# Altium project Kintex_SDR.PrjPcb (part 2 of 3)

## Sheet Codec's.SchDoc: {Наименование}
size 420 x 297 mm; DocumentNumber: ВКА.821011.000.ПЗ; PageSetup: Record=PageOptions|CenterHorizontal=False|CenterVertical=False|PrintScale=0.98|XCorrection=0.00|YCorrection=0.00|PrintKind=1|BorderSize=5000000|LeftOffset=0|BottomOffset=0|Orientation=2|PaperLength=4200|PaperWidth=2970|Scale=100|PaperSource=7|PrintQuality=600|MediaType=1|DitherType=10|PrintScaleMode=1|PaperKind=A3|PaperIndex=8; Rule: PcbType=ProtelPcb
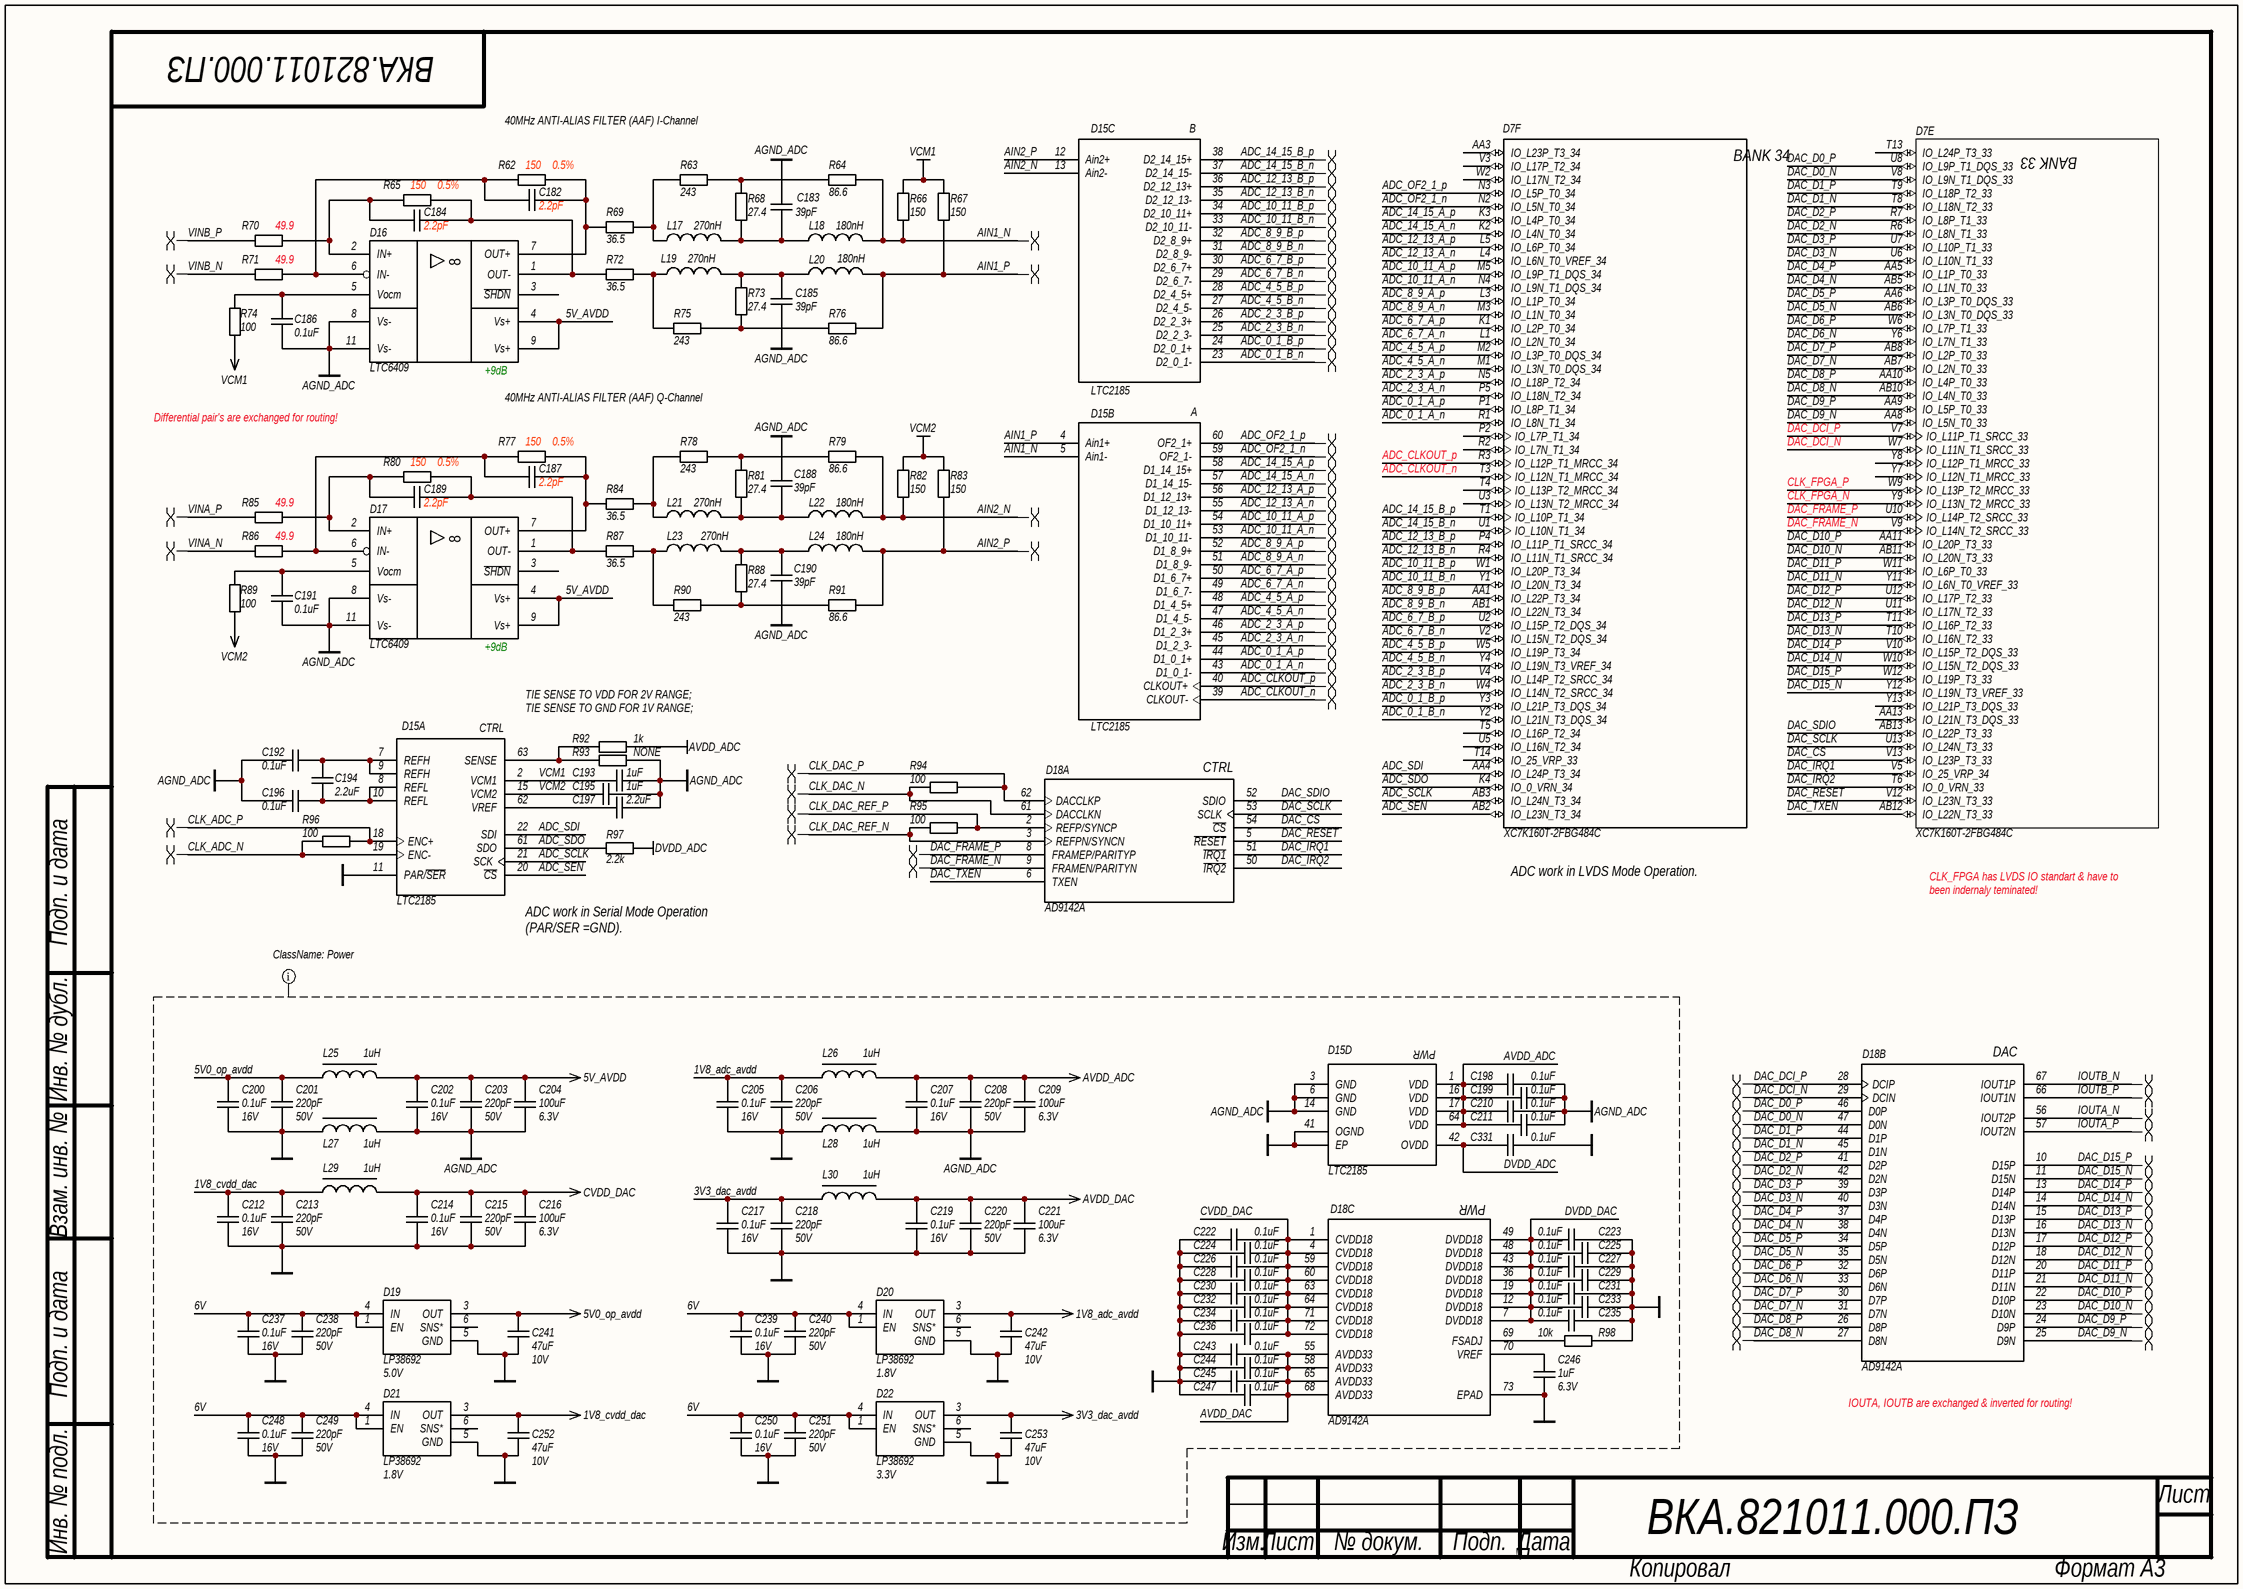
[diagram p3: Codec's.SchDoc]

### Parts
C182  value 2.2pF  [C0402]  (hidden comment: CAP)
C183  value 39pF  [C0402]  (hidden comment: CAP)
C184  value 2.2pF  [C0402]  (hidden comment: CAP)
C185  value 39pF  [C0402]  (hidden comment: CAP)
C186  value 0.1uF  [C0402]  (hidden comment: CAP)
C187  value 2.2pF  [C0402]  (hidden comment: CAP)
C188  value 39pF  [C0402]  (hidden comment: CAP)
C189  value 2.2pF  [C0402]  (hidden comment: CAP)
C190  value 39pF  [C0402]  (hidden comment: CAP)
C191  value 0.1uF  [C0402]  (hidden comment: CAP)
C192  value 0.1uF  [C0402]  (hidden comment: CAP)
C193  value 1uF  [C0402]  (hidden comment: CAP)
C194  value 2.2uF  [C0603]  (hidden comment: CAP)
C195  value 1uF  [C0402]  (hidden comment: CAP)
C196  value 0.1uF  [C0402]  (hidden comment: CAP)
C197  value 2.2uF  [C0603]  (hidden comment: CAP)
C198  value 0.1uF  [C0402]  (hidden comment: CAP)
C199  value 0.1uF  [C0402]  (hidden comment: CAP)
C200  value 0.1uF  Voltage: 16V  [C0603]  (hidden comment: CAP)
C201  value 220pF  Voltage: 50V  [C0603]  (hidden comment: CAP)
C202  value 0.1uF  Voltage: 16V  [C0603]  (hidden comment: CAP)
C203  value 220pF  Voltage: 50V  [C0603]  (hidden comment: CAP)
C204  value 100uF  Voltage: 6.3V  [C1210]  (hidden comment: CAP uF)
C205  value 0.1uF  Voltage: 16V  [C0603]  (hidden comment: CAP)
C206  value 220pF  Voltage: 50V  [C0603]  (hidden comment: CAP)
C207  value 0.1uF  Voltage: 16V  [C0603]  (hidden comment: CAP)
C208  value 220pF  Voltage: 50V  [C0603]  (hidden comment: CAP)
C209  value 100uF  Voltage: 6.3V  [C1210]  (hidden comment: CAP uF)
C210  value 0.1uF  [C0402]  (hidden comment: CAP)
C211  value 0.1uF  [C0402]  (hidden comment: CAP)
C212  value 0.1uF  Voltage: 16V  [C0603]  (hidden comment: CAP)
C213  value 220pF  Voltage: 50V  [C0603]  (hidden comment: CAP)
C214  value 0.1uF  Voltage: 16V  [C0603]  (hidden comment: CAP)
C215  value 220pF  Voltage: 50V  [C0603]  (hidden comment: CAP)
C216  value 100uF  Voltage: 6.3V  [C1210]  (hidden comment: CAP uF)
C217  value 0.1uF  Voltage: 16V  [C0603]  (hidden comment: CAP)
C218  value 220pF  Voltage: 50V  [C0603]  (hidden comment: CAP)
C219  value 0.1uF  Voltage: 16V  [C0603]  (hidden comment: CAP)
C220  value 220pF  Voltage: 50V  [C0603]  (hidden comment: CAP)
C221  value 100uF  Voltage: 6.3V  [C1210]  (hidden comment: CAP uF)
C222  value 0.1uF  [C0402]  (hidden comment: CAP)
C223  value 0.1uF  [C0402]  (hidden comment: CAP)
C224  value 0.1uF  [C0402]  (hidden comment: CAP)
C225  value 0.1uF  [C0402]  (hidden comment: CAP)
C226  value 0.1uF  [C0402]  (hidden comment: CAP)
C227  value 0.1uF  [C0402]  (hidden comment: CAP)
C228  value 0.1uF  [C0402]  (hidden comment: CAP)
C229  value 0.1uF  [C0402]  (hidden comment: CAP)
C230  value 0.1uF  [C0402]  (hidden comment: CAP)
C231  value 0.1uF  [C0402]  (hidden comment: CAP)
C232  value 0.1uF  [C0402]  (hidden comment: CAP)
C233  value 0.1uF  [C0402]  (hidden comment: CAP)
C234  value 0.1uF  [C0402]  (hidden comment: CAP)
C235  value 0.1uF  [C0402]  (hidden comment: CAP)
C236  value 0.1uF  [C0402]  (hidden comment: CAP)
C237  value 0.1uF  Voltage: 16V  [C0603]  (hidden comment: CAP)
C238  value 220pF  Voltage: 50V  [C0603]  (hidden comment: CAP)
C239  value 0.1uF  Voltage: 16V  [C0603]  (hidden comment: CAP)
C240  value 220pF  Voltage: 50V  [C0603]  (hidden comment: CAP)
C241  value 47uF  Voltage: 10V  [C1210]  (hidden comment: CAP uF)
C242  value 47uF  Voltage: 10V  [C1210]  (hidden comment: CAP uF)
C243  value 0.1uF  [C0402]  (hidden comment: CAP)
C244  value 0.1uF  [C0402]  (hidden comment: CAP)
C245  value 0.1uF  [C0402]  (hidden comment: CAP)
C246  value 1uF  Voltage: 6.3V  [C0402]  (hidden comment: CAP)
C247  value 0.1uF  [C0402]  (hidden comment: CAP)
C248  value 0.1uF  Voltage: 16V  [C0603]  (hidden comment: CAP)
C249  value 220pF  Voltage: 50V  [C0603]  (hidden comment: CAP)
C250  value 0.1uF  Voltage: 16V  [C0603]  (hidden comment: CAP)
C251  value 220pF  Voltage: 50V  [C0603]  (hidden comment: CAP)
C252  value 47uF  Voltage: 10V  [C1210]  (hidden comment: CAP uF)
C253  value 47uF  Voltage: 10V  [C1210]  (hidden comment: CAP uF)
C331  value 0.1uF  [C0402]  (hidden comment: CAP)
D7  XC7K160T-2FBG484C  [FBG484]  (parts E,F of 12)
D15  LTC2185  [QFN-64]  (parts A,B,C,D of 4)
D16  LTC6409  [QFN-10]
D17  LTC6409  [QFN-10]
D18  AD9142A  [LFCSP_VQ-72]  (parts A,B,C of 3)
D19  LP38692  Voltage: 5.0V  [SOT-223-5]
D20  LP38692  Voltage: 1.8V  [SOT-223-5]
D21  LP38692  Voltage: 1.8V  [SOT-223-5]
D22  LP38692  Voltage: 3.3V  [SOT-223-5]
L17  value 270nH  [L0603]  (hidden comment: Inductor RF)
L18  value 180nH  [L0603]  (hidden comment: Inductor RF)
L19  value 270nH  [L0603]  (hidden comment: Inductor RF)
L20  value 180nH  [L0603]  (hidden comment: Inductor RF)
L21  value 270nH  [L0603]  (hidden comment: Inductor RF)
L22  value 180nH  [L0603]  (hidden comment: Inductor RF)
L23  value 270nH  [L0603]  (hidden comment: Inductor RF)
L24  value 180nH  [L0603]  (hidden comment: Inductor RF)
L25  value 1uH  [L1210_Murata]  (hidden comment: Inductor LF)
L26  value 1uH  [L1210_Murata]  (hidden comment: Inductor LF)
L27  value 1uH  [L1210_Murata]  (hidden comment: Inductor LF)
L28  value 1uH  [L1210_Murata]  (hidden comment: Inductor LF)
L29  value 1uH  [L1210_Murata]  (hidden comment: Inductor LF)
L30  value 1uH  [L1210_Murata]  (hidden comment: Inductor LF)
R62  value 150  Tolerance: 0.5%  [R0402]  (hidden comment: RES)
R63  value 243  [R0402]  (hidden comment: RES)
R64  value 86.6  [R0402]  (hidden comment: RES)
R65  value 150  Tolerance: 0.5%  [R0402]  (hidden comment: RES)
R66  value 150  [R0402]  (hidden comment: RES)
R67  value 150  [R0402]  (hidden comment: RES)
R68  value 27.4  [R0402]  (hidden comment: RES)
R69  value 36.5  [R0402]  (hidden comment: RES)
R70  value 49.9  [R0402]  (hidden comment: RES)
R71  value 49.9  [R0402]  (hidden comment: RES)
R72  value 36.5  [R0402]  (hidden comment: RES)
R73  value 27.4  [R0402]  (hidden comment: RES)
R74  value 100  [R0402]  (hidden comment: RES)
R75  value 243  [R0402]  (hidden comment: RES)
R76  value 86.6  [R0402]  (hidden comment: RES)
R77  value 150  Tolerance: 0.5%  [R0402]  (hidden comment: RES)
R78  value 243  [R0402]  (hidden comment: RES)
R79  value 86.6  [R0402]  (hidden comment: RES)
R80  value 150  Tolerance: 0.5%  [R0402]  (hidden comment: RES)
R81  value 27.4  [R0402]  (hidden comment: RES)
R82  value 150  [R0402]  (hidden comment: RES)
R83  value 150  [R0402]  (hidden comment: RES)
R84  value 36.5  [R0402]  (hidden comment: RES)
R85  value 49.9  [R0402]  (hidden comment: RES)
R86  value 49.9  [R0402]  (hidden comment: RES)
R87  value 36.5  [R0402]  (hidden comment: RES)
R88  value 27.4  [R0402]  (hidden comment: RES)
R89  value 100  [R0402]  (hidden comment: RES)
R90  value 243  [R0402]  (hidden comment: RES)
R91  value 86.6  [R0402]  (hidden comment: RES)
R92  value 1k  [R0402]  (hidden comment: RES)
R93  value NONE  [R0402]  (hidden comment: RES)
R94  value 100  [R0402]  (hidden comment: RES)
R95  value 100  [R0402]  (hidden comment: RES)
R96  value 100  [R0402]  (hidden comment: RES)
R97  value 2.2k  [R0402]  (hidden comment: RES)
R98  value 10k  [R0402]  (hidden comment: RES)

### Nets
1V8_adc_avdd: C205.2 C206.2 C242.2 D20.3(OUT) L26.1
1V8_cvdd_dac: C212.2 C213.2 C252.2 D21.3(OUT) L29.1
3V3_dac_avdd: C217.2 C218.2 C253.2 D22.3(OUT) L30.1
5V0_op_avdd: C200.2 C201.2 C241.2 D19.3(OUT) L25.1
5V_AVDD: C202.2 C203.2 C204.2 D16.4(Vs+) D16.9(Vs+) D17.4(Vs+) D17.9(Vs+) L25.2
6V: C237.2 C238.2 C239.2 C240.2 C248.2 C249.2 C250.2 C251.2 D19.1(EN) D19.4(IN) D20.1(EN) D20.4(IN) D21.1(EN) D21.4(IN) D22.1(EN) D22.4(IN)
AGND_ADC: C183.1 C185.2 C186.1 C188.1 C190.2 C191.1 C192.2 C193.1 C195.1 C196.2 C197.1 C198.2 C199.2 C202.1 C203.1 C204.1 C207.1 C208.1 C209.1 C210.2 C211.2 D15.3(GND) D15.6(GND) D15.14(GND) D16.8(Vs-) D16.11(Vs-) D17.8(Vs-) D17.11(Vs-) L27.2 L28.2 R93.2  [project net AGND_RX]
AVDD_ADC: C198.1 C199.1 C207.2 C208.2 C209.2 C210.1 C211.1 D15.1(VDD) D15.16(VDD) D15.17(VDD) D15.64(VDD) L26.2 R92.2
AVDD_DAC: C219.2 C220.2 C221.2 C243.2 C244.2 C245.2 C247.2 D18.55(AVDD33) D18.58(AVDD33) D18.65(AVDD33) D18.68(AVDD33) L30.2
CVDD_DAC: C214.2 C215.2 C216.2 C222.2 C224.2 C226.2 C228.2 C230.2 C232.2 C234.2 C236.2 D18.1(CVDD18) D18.4(CVDD18) D18.59(CVDD18) D18.60(CVDD18) D18.63(CVDD18) D18.64(CVDD18) D18.71(CVDD18) D18.72(CVDD18) L29.2
DVDD_ADC: C331.1 D15.42(OVDD) R97.1
DVDD_DAC: C223.1 C225.1 C227.1 C229.1 C231.1 C233.1 C235.1 D18.7(DVDD18) D18.12(DVDD18) D18.19(DVDD18) D18.36(DVDD18) D18.43(DVDD18) D18.48(DVDD18) D18.49(DVDD18)
GND: C200.1 C201.1 C205.1 C206.1 C212.1 C213.1 C214.1 C215.1 C216.1 C217.1 C218.1 C219.1 C220.1 C221.1 C222.1 C223.2 C224.1 C225.2 C226.1 C227.2 C228.1 C229.2 C230.1 C231.2 C232.1 C233.2 C234.1 C235.2 C236.1 C237.1 C238.1 C239.1 C240.1 C241.1 C242.1 C243.1 C244.1 C245.1 C246.1 C247.1 C248.1 C249.1 C250.1 C251.1 C252.1 C253.1 C331.2 D15.0(EP) D15.11(PAR/~{SER}) D15.41(OGND) D18.73(EPAD) D19.5(GND) D20.5(GND) D21.5(GND) D22.5(GND) L27.1 L28.1 R98.2  [project net AGND_TX]
VCM1: C193.2 D15.2(VCM1) R66.2 R67.1 R74.2
VCM2: C195.2 D15.15(VCM2) R82.1 R83.1 R89.2
ADC_0_1_A_n: D7.R1(IO_L8N_T1_34) D15.43(D1_0_1-)
ADC_0_1_A_p: D7.P1(IO_L8P_T1_34) D15.44(D1_0_1+)
ADC_0_1_B_n: D7.Y2(IO_L21N_T3_DQS_34) D15.23(D2_0_1-)
ADC_0_1_B_p: D7.Y3(IO_L21P_T3_DQS_34) D15.24(D2_0_1+)
ADC_2_3_A_n: D7.P5(IO_L18N_T2_34) D15.45(D1_2_3-)
ADC_2_3_A_p: D7.N5(IO_L18P_T2_34) D15.46(D1_2_3+)
ADC_2_3_B_n: D7.W4(IO_L14N_T2_SRCC_34) D15.25(D2_2_3-)
ADC_2_3_B_p: D7.V4(IO_L14P_T2_SRCC_34) D15.26(D2_2_3+)
ADC_4_5_A_n: D7.M1(IO_L3N_T0_DQS_34) D15.47(D1_4_5-)
ADC_4_5_A_p: D7.M2(IO_L3P_T0_DQS_34) D15.48(D1_4_5+)
ADC_4_5_B_n: D7.Y4(IO_L19N_T3_VREF_34) D15.27(D2_4_5-)
ADC_4_5_B_p: D7.W5(IO_L19P_T3_34) D15.28(D2_4_5+)
ADC_6_7_A_n: D7.L1(IO_L2N_T0_34) D15.49(D1_6_7-)
ADC_6_7_A_p: D7.K1(IO_L2P_T0_34) D15.50(D1_6_7+)
ADC_6_7_B_n: D7.V2(IO_L15N_T2_DQS_34) D15.29(D2_6_7-)
ADC_6_7_B_p: D7.U2(IO_L15P_T2_DQS_34) D15.30(D2_6_7+)
ADC_8_9_A_n: D7.M3(IO_L1N_T0_34) D15.51(D1_8_9-)
ADC_8_9_A_p: D7.L3(IO_L1P_T0_34) D15.52(D1_8_9+)
ADC_8_9_B_n: D7.AB1(IO_L22N_T3_34) D15.31(D2_8_9-)
ADC_8_9_B_p: D7.AA1(IO_L22P_T3_34) D15.32(D2_8_9+)
ADC_10_11_A_n: D7.N4(IO_L9N_T1_DQS_34) D15.53(D1_10_11-)
ADC_10_11_A_p: D7.M5(IO_L9P_T1_DQS_34) D15.54(D1_10_11+)
ADC_10_11_B_n: D7.Y1(IO_L20N_T3_34) D15.33(D2_10_11-)
ADC_10_11_B_p: D7.W1(IO_L20P_T3_34) D15.34(D2_10_11+)
ADC_12_13_A_n: D7.L4(IO_L6N_T0_VREF_34) D15.55(D1_12_13-)
ADC_12_13_A_p: D7.L5(IO_L6P_T0_34) D15.56(D1_12_13+)
ADC_12_13_B_n: D7.R4(IO_L11N_T1_SRCC_34) D15.35(D2_12_13-)
ADC_12_13_B_p: D7.P4(IO_L11P_T1_SRCC_34) D15.36(D2_12_13+)
ADC_14_15_A_n: D7.K2(IO_L4N_T0_34) D15.57(D1_14_15-)
ADC_14_15_A_p: D7.K3(IO_L4P_T0_34) D15.58(D1_14_15+)
ADC_14_15_B_n: D7.U1(IO_L10N_T1_34) D15.37(D2_14_15-)
ADC_14_15_B_p: D7.T1(IO_L10P_T1_34) D15.38(D2_14_15+)
ADC_CLKOUT_n: D7.T3(IO_L12N_T1_MRCC_34) D15.39(CLKOUT-)
ADC_CLKOUT_p: D7.R3(IO_L12P_T1_MRCC_34) D15.40(CLKOUT+)
ADC_OF2_1_n: D7.N2(IO_L5N_T0_34) D15.59(OF2_1-)
ADC_OF2_1_p: D7.N3(IO_L5P_T0_34) D15.60(OF2_1+)
ADC_SCLK: D7.AB3(IO_L24N_T3_34) D15.21(SCK)
ADC_SDI: D7.AA4(IO_L24P_T3_34) D15.22(SDI)
ADC_SDO: D7.K4(IO_0_VRN_34) D15.61(SDO) R97.2
ADC_SEN: D7.AB2(IO_L23N_T3_34) D15.20(~{CS})
AIN1_N: D15.5(Ain1-) L18.2 R64.2 R66.1
AIN1_P: D15.4(Ain1+) L20.2 R67.2 R76.2
AIN2_N: D15.13(Ain2-) L22.2 R79.2 R82.2
AIN2_P: D15.12(Ain2+) L24.2 R83.2 R91.2
CLK_ADC_N: D15.19(ENC-) R96.1
CLK_ADC_P: D15.18(ENC+) R96.2
CLK_DAC_N: D18.61(DACCLKN) R94.1
CLK_DAC_P: D18.62(DACCLKP) R94.2
CLK_DAC_REF_N: D18.3(REFPN/SYNCN) R95.1
CLK_DAC_REF_P: D18.2(REFP/SYNCP) R95.2
CLK_FPGA_N: D7.Y9(IO_L13N_T2_MRCC_33)
CLK_FPGA_P: D7.W9(IO_L13P_T2_MRCC_33)
DAC_CS: D7.V13(IO_L23P_T3_33) D18.54(~{CS})
DAC_D0_N: D7.V8(IO_L9N_T1_DQS_33) D18.47(D0N)
DAC_D0_P: D7.U8(IO_L9P_T1_DQS_33) D18.46(D0P)
DAC_D1_N: D7.T8(IO_L18N_T2_33) D18.45(D1N)
DAC_D1_P: D7.T9(IO_L18P_T2_33) D18.44(D1P)
DAC_D2_N: D7.R6(IO_L8N_T1_33) D18.42(D2N)
DAC_D2_P: D7.R7(IO_L8P_T1_33) D18.41(D2P)
DAC_D3_N: D7.U6(IO_L10N_T1_33) D18.40(D3N)
DAC_D3_P: D7.U7(IO_L10P_T1_33) D18.39(D3P)
DAC_D4_N: D7.AB5(IO_L1N_T0_33) D18.38(D4N)
DAC_D4_P: D7.AA5(IO_L1P_T0_33) D18.37(D4P)
DAC_D5_N: D7.AB6(IO_L3N_T0_DQS_33) D18.35(D5N)
DAC_D5_P: D7.AA6(IO_L3P_T0_DQS_33) D18.34(D5P)
DAC_D6_N: D7.Y6(IO_L7N_T1_33) D18.33(D6N)
DAC_D6_P: D7.W6(IO_L7P_T1_33) D18.32(D6P)
DAC_D7_N: D7.AB7(IO_L2N_T0_33) D18.31(D7N)
DAC_D7_P: D7.AB8(IO_L2P_T0_33) D18.30(D7P)
DAC_D8_N: D7.AB10(IO_L4N_T0_33) D18.27(D8N)
DAC_D8_P: D7.AA10(IO_L4P_T0_33) D18.26(D8P)
DAC_D9_N: D7.AA8(IO_L5N_T0_33) D18.25(D9N)
DAC_D9_P: D7.AA9(IO_L5P_T0_33) D18.24(D9P)
DAC_D10_N: D7.AB11(IO_L20N_T3_33) D18.23(D10N)
DAC_D10_P: D7.AA11(IO_L20P_T3_33) D18.22(D10P)
DAC_D11_N: D7.Y11(IO_L6N_T0_VREF_33) D18.21(D11N)
DAC_D11_P: D7.W11(IO_L6P_T0_33) D18.20(D11P)
DAC_D12_N: D7.U11(IO_L17N_T2_33) D18.18(D12N)
DAC_D12_P: D7.U12(IO_L17P_T2_33) D18.17(D12P)
DAC_D13_N: D7.T10(IO_L16N_T2_33) D18.16(D13N)
DAC_D13_P: D7.T11(IO_L16P_T2_33) D18.15(D13P)
DAC_D14_N: D7.W10(IO_L15N_T2_DQS_33) D18.14(D14N)
DAC_D14_P: D7.V10(IO_L15P_T2_DQS_33) D18.13(D14P)
DAC_D15_N: D7.Y12(IO_L19N_T3_VREF_33) D18.11(D15N)
DAC_D15_P: D7.W12(IO_L19P_T3_33) D18.10(D15P)
DAC_DCI_N: D7.W7(IO_L11N_T1_SRCC_33) D18.29(DCIN)
DAC_DCI_P: D7.V7(IO_L11P_T1_SRCC_33) D18.28(DCIP)
DAC_FRAME_N: D7.V9(IO_L14N_T2_SRCC_33) D18.9(FRAMEN/PARITYN)
DAC_FRAME_P: D7.U10(IO_L14P_T2_SRCC_33) D18.8(FRAMEP/PARITYP)
DAC_IRQ1: D7.V5(IO_25_VRP_34) D18.51(~{IRQ1})
DAC_IRQ2: D7.T6(IO_0_VRN_33) D18.50(~{IRQ2})
DAC_RESET: D7.V12(IO_L23N_T3_33) D18.5(~{RESET})
DAC_SCLK: D7.U13(IO_L24N_T3_33) D18.53(SCLK)
DAC_SDIO: D7.AB13(IO_L22P_T3_33) D18.52(SDIO)
DAC_TXEN: D7.AB12(IO_L22N_T3_33) D18.6(TXEN)
IOUTA_N: D18.56(IOUT2P)
IOUTA_P: D18.57(IOUT2N)
IOUTB_N: D18.67(IOUT1P)
IOUTB_P: D18.66(IOUT1N)
VINA_N: R86.2
VINA_P: R85.2
VINB_N: R71.2
VINB_P: R70.2
NetC182_1: C182.1 D16.6(IN-) R62.1 R71.1
NetC182_2: C182.2 D16.7(OUT+) R62.2 R69.2
NetC183_2: C183.2 L17.2 L18.1 R68.2
NetC184_1: C184.1 D16.2(IN+) R65.1 R70.1
NetC184_2: C184.2 D16.1(OUT-) R65.2 R72.2
NetC185_1: C185.1 L19.2 L20.1 R73.1
NetC186_2: C186.2 D16.5(Vocm) R74.1
NetC187_1: C187.1 D17.6(IN-) R77.1 R86.1
NetC187_2: C187.2 D17.7(OUT+) R77.2 R84.2
NetC188_2: C188.2 L21.2 L22.1 R81.2
NetC189_1: C189.1 D17.2(IN+) R80.1 R85.1
NetC189_2: C189.2 D17.1(OUT-) R80.2 R87.2
NetC190_1: C190.1 L23.2 L24.1 R88.1
NetC191_2: C191.2 D17.5(Vocm) R89.1
NetC192_1: C192.1 C194.1 D15.7(REFH) D15.9(REFH)
NetC194_2: C194.2 C196.1 D15.8(REFL) D15.10(REFL)
NetC197_2: C197.2 D15.62(VREF)
NetC246_2: C246.2 D18.70(VREF)
NetD15_63: D15.63(SENSE) R92.1 R93.1
NetD18_69: D18.69(FSADJ) R98.1
NetL17_1: L17.1 R63.1 R69.1
NetL19_1: L19.1 R72.1 R75.1
NetL21_1: L21.1 R78.1 R84.1
NetL23_1: L23.1 R87.1 R90.1
NetR63_2: R63.2 R64.1 R68.1
NetR73_2: R73.2 R75.2 R76.1
NetR78_2: R78.2 R79.1 R81.1
NetR88_2: R88.2 R90.2 R91.1

Not connected (* = marked no-connect by the designer): D7 AA3(IO_L23P_T3_34) AA13(IO_L21N_T3_DQS_33) P2(IO_L7P_T1_34) R2(IO_L7N_T1_34) T4(IO_L13P_T2_MRCC_34) T5(IO_L16P_T2_34) T13(IO_L24P_T3_33) T14(IO_25_VRP_33) U3(IO_L13N_T2_MRCC_34) U5(IO_L16N_T2_34) V3(IO_L17P_T2_34) W2(IO_L17N_T2_34) Y7(IO_L12N_T1_MRCC_33) Y8(IO_L12P_T1_MRCC_33) Y13(IO_L21P_T3_DQS_33); D16 3(~{SHDN}); D17 3(~{SHDN}); D19 6(SNS*); D20 6(SNS*); D21 6(SNS*); D22 6(SNS*)

### Layout directives
differential pair: ADC_0_1_A_n, ADC_0_1_A_p, ADC_0_1_B_n, ADC_0_1_B_p, ADC_2_3_A_n, ADC_2_3_A_p, ADC_2_3_B_n, ADC_2_3_B_p, ADC_4_5_A_n, ADC_4_5_A_p, ADC_4_5_B_n, ADC_4_5_B_p, ADC_6_7_A_n, ADC_6_7_A_p, ADC_6_7_B_n, ADC_6_7_B_p, ADC_8_9_A_n, ADC_8_9_A_p, ADC_8_9_B_n, ADC_8_9_B_p, ADC_10_11_A_n, ADC_10_11_A_p, ADC_10_11_B_n, ADC_10_11_B_p, ADC_12_13_A_n, ADC_12_13_A_p, ADC_12_13_B_n, ADC_12_13_B_p, ADC_14_15_A_n, ADC_14_15_A_p, ADC_14_15_B_n, ADC_14_15_B_p, ADC_CLKOUT_n, ADC_CLKOUT_p, ADC_OF2_1_n, ADC_OF2_1_p, AIN1_N, AIN1_P, AIN2_N, AIN2_P, CLK_ADC_N, CLK_ADC_P, CLK_DAC_N, CLK_DAC_P, CLK_DAC_REF_N, CLK_DAC_REF_P, DAC_D0_N, DAC_D0_P, DAC_D1_N, DAC_D1_P, DAC_D2_N, DAC_D2_P, DAC_D3_N, DAC_D3_P, DAC_D4_N, DAC_D4_P, DAC_D5_N, DAC_D5_P, DAC_D6_N, DAC_D6_P, DAC_D7_N, DAC_D7_P, DAC_D8_N, DAC_D8_P, DAC_D9_N, DAC_D9_P, DAC_D10_N, DAC_D10_P, DAC_D11_N, DAC_D11_P, DAC_D12_N, DAC_D12_P, DAC_D13_N, DAC_D13_P, DAC_D14_N, DAC_D14_P, DAC_D15_N, DAC_D15_P, DAC_DCI_N, DAC_DCI_P, DAC_FRAME_N, DAC_FRAME_P, IOUTA_N, IOUTA_P, IOUTB_N, IOUTB_P, VINA_N, VINA_P, VINB_N, VINB_P
net class Power: 1V8_adc_avdd, 1V8_cvdd_dac, 3V3_dac_avdd, 5V0_op_avdd, 5V_AVDD, 6V, AGND_ADC, AVDD_ADC, AVDD_DAC, CVDD_DAC, DVDD_ADC, DVDD_DAC, GND

### Notes on the sheet
- 40MHz ANTI-ALIAS FILTER (AAF) I-Channel
- (near D16) +9dB
- Differential pair's are exchanged for routing!
- 40MHz ANTI-ALIAS FILTER (AAF) Q-Channel
- (near D17) +9dB
- TIE SENSE TO VDD FOR 2V RANGE;
  TIE SENSE TO GND FOR 1V RANGE;
- ADC work in Serial Mode Operation (PAR/SER =GND).
- (near D7) ADC work in LVDS Mode Operation.
- CLK_FPGA has LVDS IO standart & have to been indernaly teminated!
- IOUTA, IOUTB are exchanged & inverted for routing!
- Подп. и дата
- Инв. № дубл.
- Взам. инв. №
- Инв. № подл.
- Лист
- Изм.
- № докум.
- Подп.
- Дата
- Копировал
- Формат А3
- (in symbol AD9142A, part A) CTRL
- (in symbol AD9142A, part B) DAC
- (in symbol AD9142A, part C) PWR
- (in symbol LTC2185, part A) CTRL
- (in symbol LTC2185, part B) A
- (in symbol LTC2185, part C) B
- (in symbol LTC2185, part D) PWR
- (in symbol XC7K160T-2FBG484C, part E) BANK 33
- (in symbol XC7K160T-2FBG484C, part F) BANK 34

### Library data of the parts
C182 C184 C187 C189 = CAP: SMD Capacitor; Manufacturer: Murata; Material: NP0; Tolerance: 0.1pF; Voltage: 25V; Type: Ceramic Capacitor; P/N: GRM1555C1E2R2BA01D
C183 C185 C188 C190 = CAP: SMD Capacitor; Manufacturer: Murata; Material: NP0; Tolerance: 1%; Voltage: 50V; Type: Ceramic Capacitor; P/N: GRM1555C1H390FA01D
C186 C191 C192 C196 = CAP: SMD Capacitor; Manufacturer: Murata; Material: X7R; Tolerance: 10%; Voltage: 50V; Type: Ceramic Capacitor; P/N: GRM155R71H104KE14J
C193 C195 = CAP: SMD Capacitor; Manufacturer: Murata; Material: X7R; Tolerance: 10%; Voltage: 6.3V; Type: Ceramic Capacitor; P/N: GRM155R70J105KA12D
C194 C197 = CAP: SMD Capacitor; Manufacturer: Murata; Material: X7R; Tolerance: 10%; Voltage: 10V; Type: Ceramic Capacitor; P/N: GRM188R71A225KE15D
C198 C199 C210 C211 C222-C236 C243-C245 C247 C331 = CAP: SMD Capacitor; Manufacturer: Murata; Material: X7R; Tolerance: 10%; Voltage: 16V; Type: Ceramic Capacitor; P/N: GRM155R71C104KA88J
C200 C202 C205 C207 C212 C214 C217 C219 C237 C239 C248 C250 = CAP: SMD Capacitor; Manufacturer: Murata; Material: X7R; Tolerance: 10%; Type: Ceramic Capacitor; P/N: GRM188R71C104KA01D
C201 C203 C206 C208 C213 C215 C218 C220 C238 C240 C249 C251 = CAP: SMD Capacitor; Manufacturer: Murata; Material: X7R; Tolerance: 10%; Type: Ceramic Capacitor; P/N: GRM188R71H221KA01D
C204 C209 C216 C221 = CAP uF: SMD Capacitor; Manufacturer: Murata; Material: X5R; Tolerance: 20%; Type: Ceramic Capacitor; P/N: GRM32ER60J107ME20L
C241 C242 C252 C253 = CAP uF: SMD Capacitor; Manufacturer: Murata; Material: X7R; Tolerance: 10%; Type: Ceramic Capacitor; P/N: GRM32ER71A476KE15L
C246 = CAP: SMD Capacitor; Manufacturer: Murata; Material: X7R; Tolerance: 10%; Type: Ceramic Capacitor; P/N: GRM155R70J105KA12D
D7 = XC7K160T-2FBG484C: Xilinx 7-Series FPGA; Speed Grade: -2; Manufacturer: Xilinx; Name: XC7K160T-2FBG484C; Series: 7-Series FPGA; Package: 484 Ball FBG
D15 = LTC2185: Dual 16-Bit, 125Msps  Low Power 3V ADC; Name: LTC2185CUP#PBF-ND; Power Dissipation: 370mW; Resolution: 16 Bits; Sampling Frequency: 125 MHz; Type: Dual 16-Bit, 105Msps  Low Power 3V ADC; Voltage: Single 1.8V Supply; Package: 64-Pin (9mm × 9mm) QFN; Temperature Range: 0°C to 70°C
D16 D17 = LTC6409: Differential Amplifier/ADC   Driver; Manufacturer: Linear Technology; Name: LTC6409CUDB#TRMPBF; Voltage: 2.7V to 5.25V; Type: Very high speed, low distortion, differential amplifier.; Package: 10-Lead 3mm ×2mm ×0.75mm QFN; Temperature Range: –40°C to 125°C
D18 = AD9142A: Dual, 16-Bit, 1600 MSPS, TxDAC+   Digital-to-Analog Converter; Name: AD9142ABCPZ; Power Dissipation: 1.5 W at 1.25 GSPS; Resolution: 16 bit; Sampling Frequency: 575 MHz; Voltage: 3.3V, 1.8V; Package: 72-lead LFCSP; Temperature Range: −40°C to +85°C; Type: Dual, 16-Bit, 1600 MSPS, TxDAC+   Digital-to-Analog Converter
D19 = LP38692: Linear Regulator; P/N: LP38692MP-5.0/NOPB
D20 D21 = LP38692: Linear Regulator; P/N: LP38692MP-1.8/NOPB
D22 = LP38692: Linear Regulator; P/N: LP38692MP-3.3/NOPB
L17 L19 L21 L23 = Inductor RF: Chip SMD Inductor; Manufacturer: Murata; Current: 250mA; Frequency: 1.25GHz; Name: LQW18; Tolerance: ±2%; P/N: LQW18ANR27G80D; Series: LQW; Temperature Range: -25…85°C
L18 L20 L22 L24 = Inductor RF: Chip SMD Inductor; Manufacturer: Murata; Current: 250mA; Frequency: 1.35GHz; Name: LQW18; Tolerance: ±2%; P/N: LQW18ANR18G80D; Series: LQW; Temperature Range: -25…85°C
L25-L30 = Inductor LF: Inductor Power Lines; Manufacturer: Murata; Name: LQM32PN1R0MG0; Current: 2500mA; Tolerance: 5%; Frequency: 100MHz; Temperature Range: -25ºC to 85ºC; P/N: LQM32PN1R0MG0
  L25-L27: Series: LQM
  L28 L30: Series: LQM32
  L29: Series: LQH
R62 R65 R77 R80 = RES: SMD Resistor; Manufacturer: Panasonic Electronic Components; Name: Chip SMD Resistor; Power: 0.062 Wt; P/N: ERJ-2RHD1500X; Temperature Range: -55…155°C
R63 R75 R78 R90 = RES: SMD Resistor; Manufacturer: Panasonic Electronic Components; Name: Chip SMD Resistor; Power: 0.062 Wt; Tolerance: 1%; P/N: ERJ-2RKF2430X; Temperature Range: -55…155°C
R64 R76 R79 R91 = RES: SMD Resistor; Manufacturer: Panasonic Electronic Components; Name: Chip SMD Resistor; Power: 0.062 Wt; Tolerance: 1%; P/N: ERJ-2RKF86R6X; Temperature Range: -55…155°C
R66 R67 R82 R83 = RES: SMD Resistor; Manufacturer: Panasonic Electronic Components; Name: Chip SMD Resistor; Power: 0.062 Wt; Tolerance: 1%; P/N: ERJ-2RKF1500X; Temperature Range: -55…155°C
R68 R73 R81 R88 = RES: SMD Resistor; Manufacturer: Panasonic Electronic Components; Name: Chip SMD Resistor; Power: 0.062 Wt; Tolerance: 1%; P/N: ERJ-2RKF27R4X; Temperature Range: -55…155°C
R69 R72 R84 R87 = RES: SMD Resistor; Manufacturer: Panasonic Electronic Components; Name: Chip SMD Resistor; Power: 0.062 Wt; Tolerance: 1%; P/N: ERJ-2RKF36R5X; Temperature Range: -55…155°C
R70 R71 R85 R86 = RES: SMD Resistor; Manufacturer: Panasonic Electronic Components; Name: Chip SMD Resistor; Power: 0.063 Wt; Tolerance: 0.5%; P/N: ERJ-2RKD49R9X; Temperature Range: -55…155°C
R74 R89 R94-R96 = RES: SMD Resistor; Manufacturer: Panasonic Electronic Components; Name: Chip SMD Resistor; Power: 0.062 Wt; Tolerance: 5%; P/N: ERJ-2GEJ101X; Temperature Range: -55…155°C
R92 = RES: SMD Resistor; Manufacturer: Panasonic Electronic Components; Name: Chip SMD Resistor; Power: 0.062 Wt; Tolerance: 5%; P/N: ERJ-2GEJ102X; Temperature Range: -55…155°C
R93 = RES: SMD Resistor; Manufacturer: Panasonic Electronic Components; Name: Chip SMD Resistor; Power: 0.062 Wt; P/N: ERJ-2GE0R00X; Temperature Range: -55…155°C
R97 = RES: SMD Resistor; Name: Chip SMD Resistor; Power: 0.062 Wt; Tolerance: 5%; P/N: ERJ-2GEJ222X; Temperature Range: -55…155°C
R98 = RES: SMD Resistor; Manufacturer: Panasonic Electronic Components; Name: Chip SMD Resistor; Power: 0.062 Wt; Tolerance: 5%; P/N: ERJ-2GEJ103X; Temperature Range: -55…155°C

## Sheet DaughterBoard.SchDoc: {Наименование}
size 420 x 297 mm; DocumentNumber: ВКА.821011.000.ПЗ; PageSetup: Record=PageOptions|CenterHorizontal=False|CenterVertical=False|PrintScale=0.95|XCorrection=0.00|YCorrection=0.00|PrintKind=1|BorderSize=5000000|LeftOffset=0|BottomOffset=0|Orientation=1|PaperLength=1000|PaperWidth=1000|Scale=100|PaperSource=15|PrintQuality=600|MediaType=1|DitherType=10|PaperKind=A4|PrintScaleMode=1; Rule: PcbType=ProtelPcb
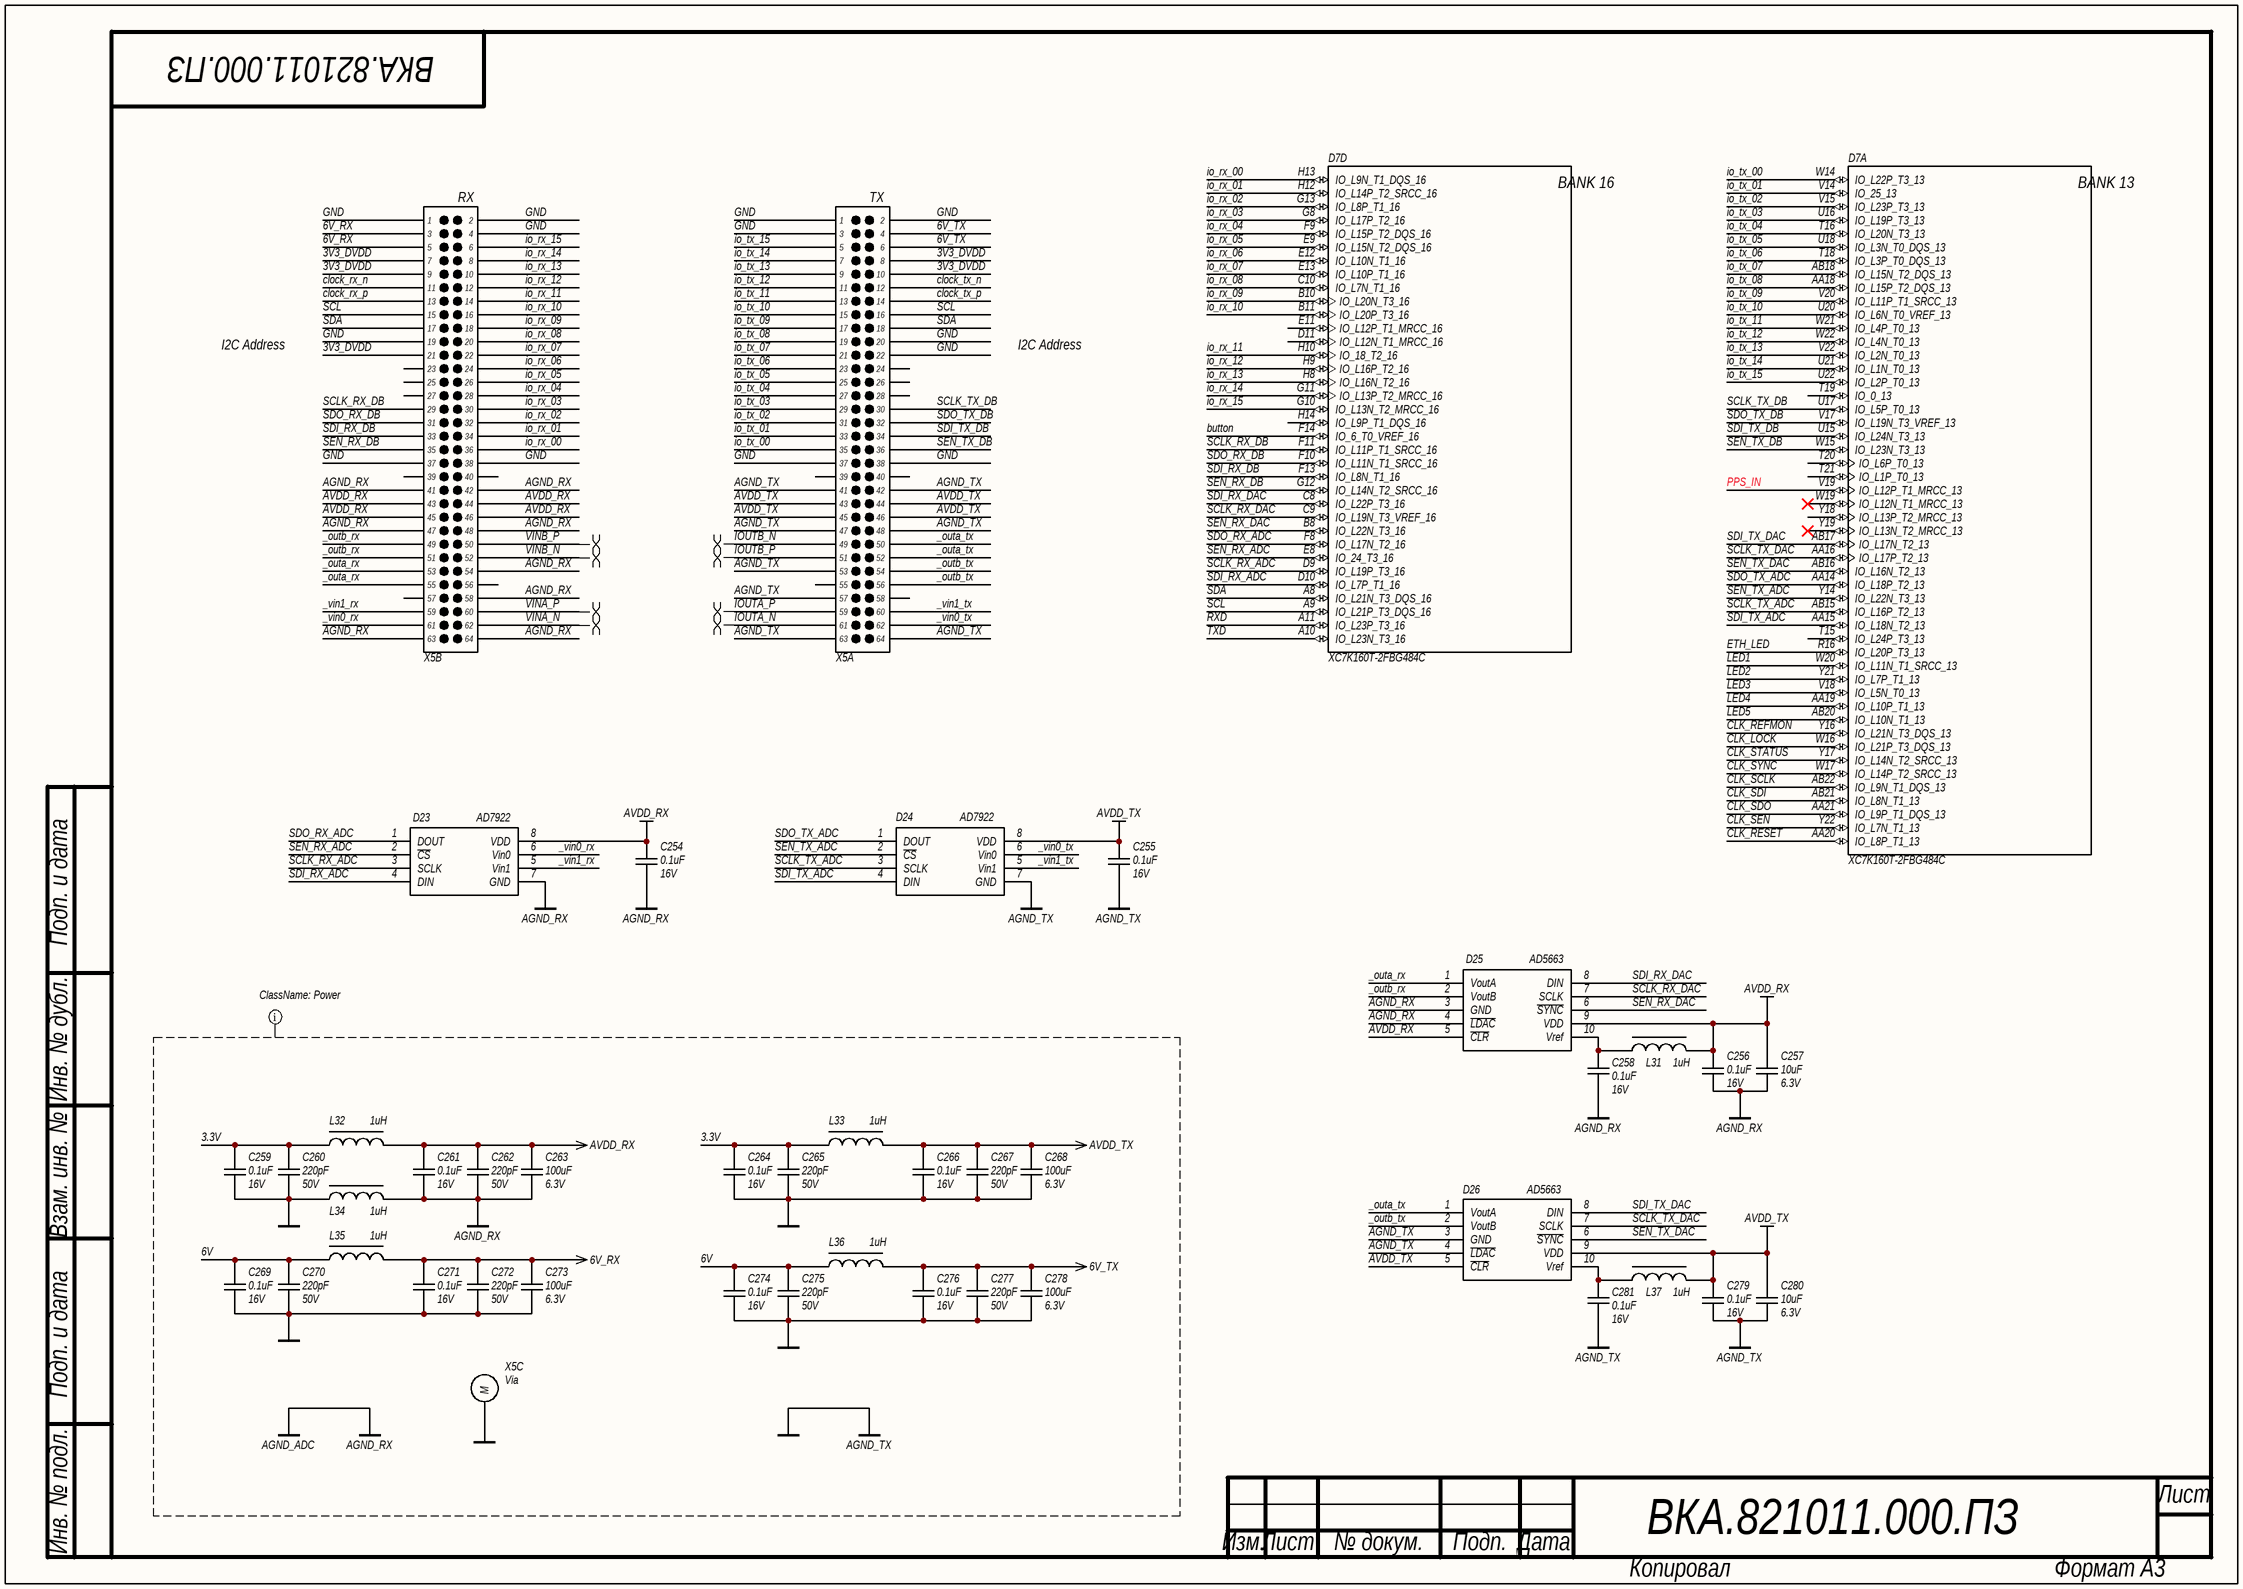
[diagram p4: DaughterBoard.SchDoc]

### Parts
C254  value 0.1uF  Voltage: 16V  [C0402]  (hidden comment: CAP)
C255  value 0.1uF  Voltage: 16V  [C0402]  (hidden comment: CAP)
C256  value 0.1uF  Voltage: 16V  [C0402]  (hidden comment: CAP)
C257  value 10uF  Voltage: 6.3V  [C0603]  (hidden comment: CAP)
C258  value 0.1uF  Voltage: 16V  [C0402]  (hidden comment: CAP)
C259  value 0.1uF  Voltage: 16V  [C0603]  (hidden comment: CAP)
C260  value 220pF  Voltage: 50V  [C0603]  (hidden comment: CAP)
C261  value 0.1uF  Voltage: 16V  [C0603]  (hidden comment: CAP)
C262  value 220pF  Voltage: 50V  [C0603]  (hidden comment: CAP)
C263  value 100uF  Voltage: 6.3V  [C1210]  (hidden comment: CAP uF)
C264  value 0.1uF  Voltage: 16V  [C0603]  (hidden comment: CAP)
C265  value 220pF  Voltage: 50V  [C0603]  (hidden comment: CAP)
C266  value 0.1uF  Voltage: 16V  [C0603]  (hidden comment: CAP)
C267  value 220pF  Voltage: 50V  [C0603]  (hidden comment: CAP)
C268  value 100uF  Voltage: 6.3V  [C1210]  (hidden comment: CAP uF)
C269  value 0.1uF  Voltage: 16V  [C0603]  (hidden comment: CAP)
C270  value 220pF  Voltage: 50V  [C0603]  (hidden comment: CAP)
C271  value 0.1uF  Voltage: 16V  [C0603]  (hidden comment: CAP)
C272  value 220pF  Voltage: 50V  [C0603]  (hidden comment: CAP)
C273  value 100uF  Voltage: 6.3V  [C1210]  (hidden comment: CAP uF)
C274  value 0.1uF  Voltage: 16V  [C0603]  (hidden comment: CAP)
C275  value 220pF  Voltage: 50V  [C0603]  (hidden comment: CAP)
C276  value 0.1uF  Voltage: 16V  [C0603]  (hidden comment: CAP)
C277  value 220pF  Voltage: 50V  [C0603]  (hidden comment: CAP)
C278  value 100uF  Voltage: 6.3V  [C1210]  (hidden comment: CAP uF)
C279  value 0.1uF  Voltage: 16V  [C0402]  (hidden comment: CAP)
C280  value 10uF  Voltage: 6.3V  [C0603]  (hidden comment: CAP)
C281  value 0.1uF  Voltage: 16V  [C0402]  (hidden comment: CAP)
D7  XC7K160T-2FBG484C  [FBG484]  (parts A,D of 12)
D23  AD7922  [MSOP-8]
D24  AD7922  [MSOP-8]
D25  AD5663  [MSOP-10]
D26  AD5663  [MSOP-10]
L31  value 1uH  [L1206_Murata]  (hidden comment: Inductor LF)
L32  value 1uH  [L1210_Murata LQH]  (hidden comment: Inductor LF)
L33  value 1uH  [L1210_Murata LQH]  (hidden comment: Inductor LF)
L34  value 1uH  [L1210_Murata LQH]  (hidden comment: Inductor LF)
L35  value 1uH  [L1210_Murata LQH]  (hidden comment: Inductor LF)
L36  value 1uH  [L1210_Murata LQH]  (hidden comment: Inductor LF)
L37  value 1uH  [L1206_Murata]  (hidden comment: Inductor LF)
X5  DBoard  [DBoard]  (value not drawn)  (parts A,B,C of 3)

### Nets
3.3V: C259.2 C260.2 C264.2 C265.2 L32.1 L33.1
3V3_DVDD: X5.8 X5.10 X5.71(7) X5.73(9) X5.85(21)
6V: C269.2 C270.2 C274.2 C275.2 L35.1 L36.1
6V_RX: C271.2 C272.2 C273.2 L35.2 X5.67(3) X5.69(5)
6V_TX: C276.2 C277.2 C278.2 L36.2 X5.4 X5.6
AGND_RX: C254.1 C256.1 C257.1 C258.1 C261.1 C262.1 C263.1 D23.7(GND) D25.3(GND) D25.4(~{LDAC}) L34.2 X5.105(41) X5.106(42) X5.111(47) X5.112(48) X5.118(54) X5.122(58) X5.127(63) X5.128(64)  [also labelled AGND_ADC]
AGND_TX: C255.1 C259.1 C260.1 C264.1 C265.1 C266.1 C267.1 C268.1 C269.1 C270.1 C271.1 C272.1 C273.1 C274.1 C275.1 C276.1 C277.1 C278.1 C279.1 C280.1 C281.1 D24.7(GND) D26.3(GND) D26.4(~{LDAC}) L34.1 X5.0(M) X5.1 X5.2 X5.3 X5.20 X5.22 X5.37 X5.38 X5.41 X5.42 X5.47 X5.48 X5.53 X5.57 X5.63 X5.64 X5.65(1) X5.66(2) X5.68(4) X5.83(19) X5.101(37) X5.102(38)  [also labelled GND]
AVDD_RX: C254.2 C256.2 C257.2 C261.2 C262.2 C263.2 D23.8(VDD) D25.5(~{CLR}) D25.9(VDD) L31.2 L32.2 X5.107(43) X5.108(44) X5.109(45) X5.110(46)
AVDD_TX: C255.2 C266.2 C267.2 C268.2 C279.2 C280.2 D24.8(VDD) D26.5(~{CLR}) D26.9(VDD) L33.2 L37.2 X5.43 X5.44 X5.45 X5.46
_outa_rx: D25.1(VoutA) X5.117(53) X5.119(55)
_outa_tx: D26.1(VoutA) X5.50 X5.52
_outb_rx: D25.2(VoutB) X5.113(49) X5.115(51)
_outb_tx: D26.2(VoutB) X5.54 X5.56
_vin0_rx: D23.6(Vin0) X5.125(61)
_vin0_tx: D24.6(Vin0) X5.62
_vin1_rx: D23.5(Vin1) X5.123(59)
_vin1_tx: D24.5(Vin1) X5.60
button: D7.F14(IO_6_T0_VREF_16)
CLK_LOCK: D7.W16(IO_L21P_T3_DQS_13)
CLK_REFMON: D7.Y16(IO_L21N_T3_DQS_13)
CLK_RESET: D7.AA20(IO_L8P_T1_13)
CLK_SCLK: D7.AB22(IO_L9N_T1_DQS_13)
CLK_SDI: D7.AB21(IO_L8N_T1_13)
CLK_SDO: D7.AA21(IO_L9P_T1_DQS_13)
CLK_SEN: D7.Y22(IO_L7N_T1_13)
CLK_STATUS: D7.Y17(IO_L14N_T2_SRCC_13)
CLK_SYNC: D7.W17(IO_L14P_T2_SRCC_13)
clock_rx_n: X5.75(11)
clock_rx_p: X5.77(13)
clock_tx_n: X5.12
clock_tx_p: X5.14
ETH_LED: D7.R16(IO_L20P_T3_13)
io_rx_00: D7.H13(IO_L9N_T1_DQS_16) X5.100(36)
io_rx_01: D7.H12(IO_L14P_T2_SRCC_16) X5.98(34)
io_rx_02: D7.G13(IO_L8P_T1_16) X5.96(32)
io_rx_03: D7.G8(IO_L17P_T2_16) X5.94(30)
io_rx_04: D7.F9(IO_L15P_T2_DQS_16) X5.92(28)
io_rx_05: D7.E9(IO_L15N_T2_DQS_16) X5.90(26)
io_rx_06: D7.E12(IO_L10N_T1_16) X5.88(24)
io_rx_07: D7.E13(IO_L10P_T1_16) X5.86(22)
io_rx_08: D7.C10(IO_L7N_T1_16) X5.84(20)
io_rx_09: D7.B10(IO_L20N_T3_16) X5.82(18)
io_rx_10: D7.B11(IO_L20P_T3_16) X5.80(16)
io_rx_11: D7.H10(IO_18_T2_16) X5.78(14)
io_rx_12: D7.H9(IO_L16P_T2_16) X5.76(12)
io_rx_13: D7.H8(IO_L16N_T2_16) X5.74(10)
io_rx_14: D7.G11(IO_L13P_T2_MRCC_16) X5.72(8)
io_rx_15: D7.G10(IO_L13N_T2_MRCC_16) X5.70(6)
io_tx_00: D7.W14(IO_L22P_T3_13) X5.35
io_tx_01: D7.V14(IO_25_13) X5.33
io_tx_02: D7.V15(IO_L23P_T3_13) X5.31
io_tx_03: D7.U16(IO_L19P_T3_13) X5.29
io_tx_04: D7.T16(IO_L20N_T3_13) X5.27
io_tx_05: D7.U18(IO_L3N_T0_DQS_13) X5.25
io_tx_06: D7.T18(IO_L3P_T0_DQS_13) X5.23
io_tx_07: D7.AB18(IO_L15N_T2_DQS_13) X5.21
io_tx_08: D7.AA18(IO_L15P_T2_DQS_13) X5.19
io_tx_09: D7.V20(IO_L11P_T1_SRCC_13) X5.17
io_tx_10: D7.U20(IO_L6N_T0_VREF_13) X5.15
io_tx_11: D7.W21(IO_L4P_T0_13) X5.13
io_tx_12: D7.W22(IO_L4N_T0_13) X5.11
io_tx_13: D7.V22(IO_L2N_T0_13) X5.9
io_tx_14: D7.U21(IO_L1N_T0_13) X5.7
io_tx_15: D7.U22(IO_L2P_T0_13) X5.5
IOUTA_N: X5.61
IOUTA_P: X5.59
IOUTB_N: X5.49
IOUTB_P: X5.51
LED1: D7.W20(IO_L11N_T1_SRCC_13)
LED2: D7.Y21(IO_L7P_T1_13)
LED3: D7.V18(IO_L5N_T0_13)
LED4: D7.AA19(IO_L10P_T1_13)
LED5: D7.AB20(IO_L10N_T1_13)
PPS_IN: D7.V19(IO_L12P_T1_MRCC_13)
RXD: D7.A11(IO_L23P_T3_16)
SCL: D7.A9(IO_L21P_T3_DQS_16) X5.16 X5.79(15)
SCLK_RX_ADC: D7.D9(IO_L19P_T3_16) D23.3(SCLK)
SCLK_RX_DAC: D7.C9(IO_L19N_T3_VREF_16) D25.7(SCLK)
SCLK_RX_DB: D7.F11(IO_L11P_T1_SRCC_16) X5.93(29)
SCLK_TX_ADC: D7.AB15(IO_L16P_T2_13) D24.3(SCLK)
SCLK_TX_DAC: D7.AA16(IO_L17P_T2_13) D26.7(SCLK)
SCLK_TX_DB: D7.U17(IO_L5P_T0_13) X5.30
SDA: D7.A8(IO_L21N_T3_DQS_16) X5.18 X5.81(17)
SDI_RX_ADC: D7.D10(IO_L7P_T1_16) D23.4(DIN)
SDI_RX_DAC: D7.C8(IO_L22P_T3_16) D25.8(DIN)
SDI_RX_DB: D7.F13(IO_L8N_T1_16) X5.97(33)
SDI_TX_ADC: D7.AA15(IO_L18N_T2_13) D24.4(DIN)
SDI_TX_DAC: D7.AB17(IO_L17N_T2_13) D26.8(DIN)
SDI_TX_DB: D7.U15(IO_L24N_T3_13) X5.34
SDO_RX_ADC: D7.F8(IO_L17N_T2_16) D23.1(DOUT)
SDO_RX_DB: D7.F10(IO_L11N_T1_SRCC_16) X5.95(31)
SDO_TX_ADC: D7.AA14(IO_L18P_T2_13) D24.1(DOUT)
SDO_TX_DB: D7.V17(IO_L19N_T3_VREF_13) X5.32
SEN_RX_ADC: D7.E8(IO_24_T3_16) D23.2(~{CS})
SEN_RX_DAC: D7.B8(IO_L22N_T3_16) D25.6(~{SYNC})
SEN_RX_DB: D7.G12(IO_L14N_T2_SRCC_16) X5.99(35)
SEN_TX_ADC: D7.Y14(IO_L22N_T3_13) D24.2(~{CS})
SEN_TX_DAC: D7.AB16(IO_L16N_T2_13) D26.6(~{SYNC})
SEN_TX_DB: D7.W15(IO_L23N_T3_13) X5.36
TXD: D7.A10(IO_L23N_T3_16)
VINA_N: X5.126(62)
VINA_P: X5.124(60)
VINB_N: X5.116(52)
VINB_P: X5.114(50)
NetC258_2: C258.2 D25.10(Vref) L31.1
NetC281_2: C281.2 D26.10(Vref) L37.1

Not connected (* = marked no-connect by the designer): D7 D11(IO_L12N_T1_MRCC_16) E11(IO_L12P_T1_MRCC_16) H14(IO_L9P_T1_DQS_16) T15(IO_L24P_T3_13) T19(IO_0_13) T20(IO_L6P_T0_13) T21(IO_L1P_T0_13) W19(IO_L12N_T1_MRCC_13)* Y18(IO_L13P_T2_MRCC_13) Y19(IO_L13N_T2_MRCC_13)*; X5 24 26 28 39 40 55 58 87(23) 89(25) 91(27) 103(39) 104(40) 120(56) 121(57)

### Layout directives
net class Power: 3.3V, 6V, 6V_RX, 6V_TX, AGND_ADC, AGND_RX, AGND_TX, AVDD_RX, AVDD_TX, GND
differential pair: IOUTA_N, IOUTA_P, IOUTB_N, IOUTB_P, VINA_N, VINA_P, VINB_N, VINB_P

### Notes on the sheet
- I2C Address
- Подп. и дата
- Инв. № дубл.
- Взам. инв. №
- Инв. № подл.
- Лист
- Изм.
- № докум.
- Подп.
- Дата
- Копировал
- Формат А3
- (in symbol DBoard, part A) TX
- (in symbol DBoard, part B) RX
- (in symbol XC7K160T-2FBG484C, part A) BANK 13
- (in symbol XC7K160T-2FBG484C, part D) BANK 16

### Library data of the parts
C254-C256 C258 C279 C281 = CAP: SMD Capacitor; Manufacturer: Murata; Material: X7R; Tolerance: 10%; Type: Ceramic Capacitor; P/N: GRM155R71C104KA88J
C257 C280 = CAP: SMD Capacitor; Manufacturer: Murata; Material: X7R; Tolerance: 10%; Type: Ceramic Capacitor; P/N: GRM188R60J106ME47J
C259 C261 C264 C266 C269 C271 C274 C276 = CAP: as C200 on sheet Codec's
C260 C262 C265 C267 C270 C272 C275 C277 = CAP: as C201 on sheet Codec's
C263 C268 C273 C278 = CAP uF: as C204 on sheet Codec's
D7 = XC7K160T-2FBG484C: Xilinx 7-Series FPGA; Speed Grade: -2; Manufacturer: Xilinx; Name: XC7K160T-2FBG484C; Series: 7-Series FPGA; Package: 484 Ball FBG
D23 D24 = AD79x2: 1 MSPS, 10-/12-Bit ADC; Manufacturer: Analog Device; Fast throughput rate: 1MHz; High speed serial interface: SPI®/QSPI™/MICROWIRE™/DSP compatible; Name: AD7922ARM; Type: 2-Channel, 2.35 V to 5.25 V,1 MSPS, 10-/12-Bit ADC; Voltage: 2.35 V to 5.25 V; Package: MSOP-8
D25 D26 = AD56x3R: Dual 12-/14-/16-Bit nanoDAC; Manufacturer: Analog Device; High speed serial interface: SPI®/QSPI™/MICROWIRE™/DSP compatibl; Name: AD5663RBRMZ-5; settling time: 4.5 μs maximum; Type: Dual 12-/14-/16-Bit nanoDAC with 5 ppm/°C On-Chip Reference; Voltage: 2.7 V to 5.5 V; Package: MSOP-10
L31 L37 = Inductor LF: Inductor Power Lines; Manufacturer: Murata; Name: LQM31PN1R0M00; Current: 2500mA; Tolerance: 5%; Frequency: 100MHz; Temperature Range: -25ºC to 85ºC; Series: LQM; P/N: LQM31PN1R0M00
L32-L36 = Inductor LF: Inductor Power Lines; Manufacturer: Murata; Name: LQH32PN1R0NNC; Current: 2500mA; Tolerance: 5%; Frequency: 100MHz; Temperature Range: -25ºC to 85ºC; Series: LQH; P/N: LQH32PN1R0NNC
X5 = DBoard: USRP DBoard; Name: 1.00mm Pitch Mezzanine 714362164

## Sheet Ethernet.SchDoc: {Наименование}
size 420 x 297 mm; DocumentNumber: ВКА.821011.000.ПЗ; PageSetup: Record=PageOptions|CenterHorizontal=False|CenterVertical=False|PrintScale=0.49|XCorrection=0.00|YCorrection=0.00|PrintKind=1|BorderSize=5000000|LeftOffset=0|BottomOffset=0|Orientation=2|PaperLength=4200|PaperWidth=2970|Scale=100|PaperSource=7|PrintQuality=600|MediaType=1|DitherType=10|PrintScaleMode=1|PaperKind=A3|PaperIndex=8; Rule: PcbType=ProtelPcb
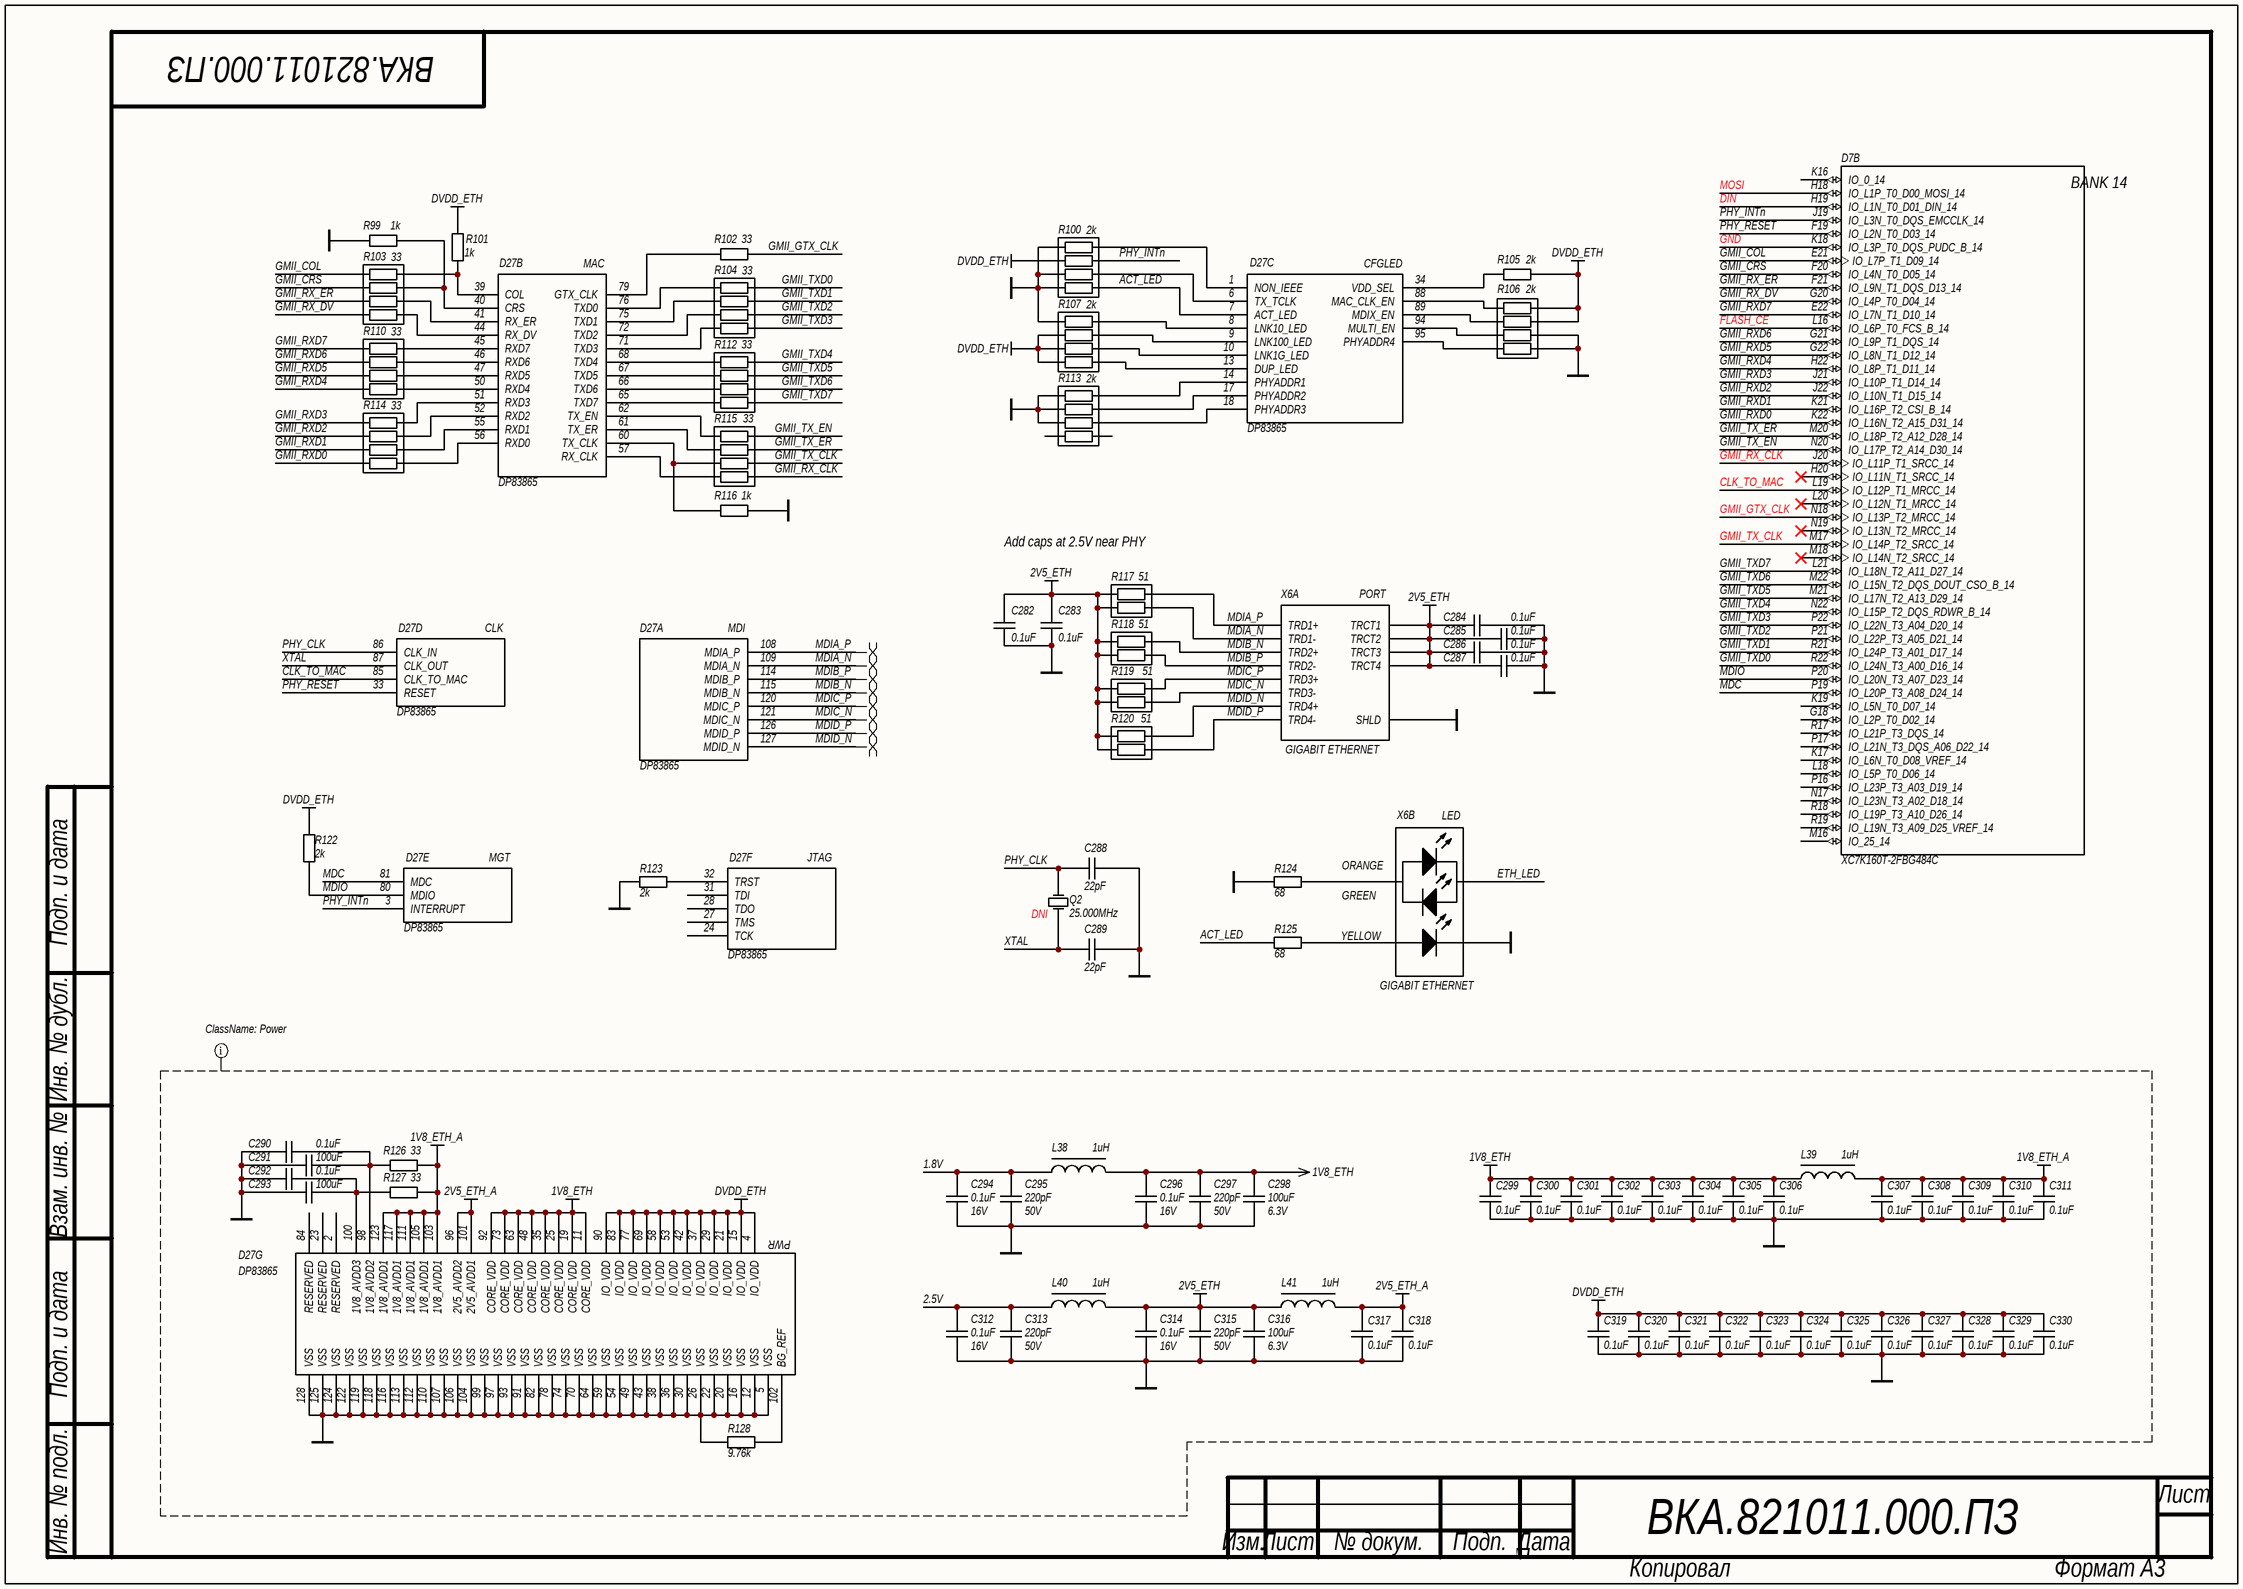
[diagram p5: Ethernet.SchDoc]

### Parts
C282  value 0.1uF  [C0402]  (hidden comment: CAP)
C283  value 0.1uF  [C0402]  (hidden comment: CAP)
C284  value 0.1uF  [C0402]  (hidden comment: CAP)
C285  value 0.1uF  [C0402]  (hidden comment: CAP)
C286  value 0.1uF  [C0402]  (hidden comment: CAP)
C287  value 0.1uF  [C0402]  (hidden comment: CAP)
C288  value 22pF  [C0402]  (hidden comment: CAP)
C289  value 22pF  [C0402]  (hidden comment: CAP)
C290  value 0.1uF  [C0402]  (hidden comment: CAP)
C291  value 100uF  [C1210]  (hidden comment: CAP uF)
C292  value 0.1uF  [C0402]  (hidden comment: CAP)
C293  value 100uF  [C1210]  (hidden comment: CAP uF)
C294  value 0.1uF  Voltage: 16V  [C0603]  (hidden comment: CAP)
C295  value 220pF  Voltage: 50V  [C0603]  (hidden comment: CAP)
C296  value 0.1uF  Voltage: 16V  [C0603]  (hidden comment: CAP)
C297  value 220pF  Voltage: 50V  [C0603]  (hidden comment: CAP)
C298  value 100uF  Voltage: 6.3V  [C1210]  (hidden comment: CAP uF)
C299  value 0.1uF  [C0402]  (hidden comment: CAP)
C300  value 0.1uF  [C0402]  (hidden comment: CAP)
C301  value 0.1uF  [C0402]  (hidden comment: CAP)
C302  value 0.1uF  [C0402]  (hidden comment: CAP)
C303  value 0.1uF  [C0402]  (hidden comment: CAP)
C304  value 0.1uF  [C0402]  (hidden comment: CAP)
C305  value 0.1uF  [C0402]  (hidden comment: CAP)
C306  value 0.1uF  [C0402]  (hidden comment: CAP)
C307  value 0.1uF  [C0402]  (hidden comment: CAP)
C308  value 0.1uF  [C0402]  (hidden comment: CAP)
C309  value 0.1uF  [C0402]  (hidden comment: CAP)
C310  value 0.1uF  [C0402]  (hidden comment: CAP)
C311  value 0.1uF  [C0402]  (hidden comment: CAP)
C312  value 0.1uF  Voltage: 16V  [C0603]  (hidden comment: CAP)
C313  value 220pF  Voltage: 50V  [C0603]  (hidden comment: CAP)
C314  value 0.1uF  Voltage: 16V  [C0603]  (hidden comment: CAP)
C315  value 220pF  Voltage: 50V  [C0603]  (hidden comment: CAP)
C316  value 100uF  Voltage: 6.3V  [C1210]  (hidden comment: CAP uF)
C317  value 0.1uF  [C0402]  (hidden comment: CAP)
C318  value 0.1uF  [C0402]  (hidden comment: CAP)
C319  value 0.1uF  [C0402]  (hidden comment: CAP)
C320  value 0.1uF  [C0402]  (hidden comment: CAP)
C321  value 0.1uF  [C0402]  (hidden comment: CAP)
C322  value 0.1uF  [C0402]  (hidden comment: CAP)
C323  value 0.1uF  [C0402]  (hidden comment: CAP)
C324  value 0.1uF  [C0402]  (hidden comment: CAP)
C325  value 0.1uF  [C0402]  (hidden comment: CAP)
C326  value 0.1uF  [C0402]  (hidden comment: CAP)
C327  value 0.1uF  [C0402]  (hidden comment: CAP)
C328  value 0.1uF  [C0402]  (hidden comment: CAP)
C329  value 0.1uF  [C0402]  (hidden comment: CAP)
C330  value 0.1uF  [C0402]  (hidden comment: CAP)
D7  XC7K160T-2FBG484C  [FBG484]  (part B of 12)
D27  DP83865  [PQFP-128]  (parts A,B,C,D,E,F,G of 7)
L38  value 1uH  [L1210_Murata LQH]  (hidden comment: Inductor LF)
L39  value 1uH  [L1210_Murata LQH]  (hidden comment: Inductor LF)
L40  value 1uH  [L1210_Murata LQH]  (hidden comment: Inductor LF)
L41  value 1uH  [L1210_Murata LQH]  (hidden comment: Inductor LF)
Q2  25.000MHz  Note: DNI  [SMT 5x7]
R99  value 1k  [R0402]  (hidden comment: RES)
R100  value 2k  [EXN8V]  (hidden comment: RES 4x0402)
R101  value 1k  [R0402]  (hidden comment: RES)
R102  value 33  [R0402]  (hidden comment: RES)
R103  value 33  [EXN8V]  (hidden comment: RES 4x0402)
R104  value 33  [EXN8V]  (hidden comment: RES 4x0402)
R105  value 2k  [R0402]  (hidden comment: RES)
R106  value 2k  [EXN8V]  (hidden comment: RES 4x0402)
R107  value 2k  [EXN8V]  (hidden comment: RES 4x0402)
R110  value 33  [EXN8V]  (hidden comment: RES 4x0402)
R112  value 33  [EXN8V]  (hidden comment: RES 4x0402)
R113  value 2k  [EXN8V]  (hidden comment: RES 4x0402)
R114  value 33  [EXN8V]  (hidden comment: RES 4x0402)
R115  value 33  [EXN8V]  (hidden comment: RES 4x0402)
R116  value 1k  [R0402]  (hidden comment: RES)
R117  value 51  [EX24V]  (hidden comment: RES 2x0402)
R118  value 51  [EX24V]  (hidden comment: RES 2x0402)
R119  value 51  [EX24V]  (hidden comment: RES 2x0402)
R120  value 51  [EX24V]  (hidden comment: RES 2x0402)
R122  value 2k  [R0402]  (hidden comment: RES)
R123  value 2k  [R0402]  (hidden comment: RES)
R124  value 68  [R0402]  (hidden comment: RES)
R125  value 68  [R0402]  (hidden comment: RES)
R126  value 33  [R0402]  (hidden comment: RES)
R127  value 33  [R0402]  (hidden comment: RES)
R128  value 9.76k  [R0402]  (hidden comment: RES)
X6  GIGABIT ETHERNET  [0826-1X1T-23-F]  (parts A,B of 2)

### Nets
1.8V: C294.2 C295.2 L38.1
1V8_ETH: C296.2 C297.2 C298.2 C299.2 C300.2 C301.2 C302.2 C303.2 C304.2 C305.2 C306.2 D27.11(CORE_VDD) D27.19(CORE_VDD) D27.25(CORE_VDD) D27.35(CORE_VDD) D27.48(CORE_VDD) D27.63(CORE_VDD) D27.73(CORE_VDD) D27.92(CORE_VDD) L38.2 L39.1
1V8_ETH_A: C307.2 C308.2 C309.2 C310.2 C311.2 D27.103(1V8_AVDD1) D27.105(1V8_AVDD1) D27.111(1V8_AVDD1) D27.117(1V8_AVDD1) D27.123(1V8_AVDD1) L39.2 R126.1 R127.1
2.5V: C312.2 C313.2 L40.1
2V5_ETH: C282.1 C283.1 C284.2 C285.2 C286.2 C287.2 C314.2 C315.2 C316.2 L40.2 L41.1 R117.1 R117.2 R118.1 R118.2 R119.1 R119.2 R120.1 R120.2 X6.1(TRCT3) X6.6(TRCT2) X6.7(TRCT4) X6.12(TRCT1)
2V5_ETH_A: C317.2 C318.2 D27.96(2V5_AVDD2) D27.101(2V5_AVDD1) L41.2
DVDD_ETH: C319.2 C320.2 C321.2 C322.2 C323.2 C324.2 C325.2 C326.2 C327.2 C328.2 C329.2 C330.2 D27.4(IO_VDD) D27.15(IO_VDD) D27.21(IO_VDD) D27.29(IO_VDD) D27.37(IO_VDD) D27.42(IO_VDD) D27.53(IO_VDD) D27.58(IO_VDD) D27.69(IO_VDD) D27.77(IO_VDD) D27.83(IO_VDD) D27.90(IO_VDD) R100.2 R101.2 R105.2 R106.5 R106.6 R107.2 R107.3 R107.4 R122.1
GND: C282.2 C283.2 C284.1 C285.1 C286.1 C287.1 C288.2 C289.2 C290.2 C291.2 C292.2 C293.2 C294.1 C295.1 C296.1 C297.1 C298.1 C299.1 C300.1 C301.1 C302.1 C303.1 C304.1 C305.1 C306.1 C307.1 C308.1 C309.1 C310.1 C311.1 C312.1 C313.1 C314.1 C315.1 C316.1 C317.1 C318.1 C319.1 C320.1 C321.1 C322.1 C323.1 C324.1 C325.1 C326.1 C327.1 C328.1 C329.1 C330.1 D7.K18(IO_L3P_T0_DQS_PUDC_B_14) D27.5(VSS) D27.12(VSS) D27.16(VSS) D27.20(VSS) D27.22(VSS) D27.26(VSS) D27.30(VSS) D27.36(VSS) D27.38(VSS) D27.43(VSS) D27.49(VSS) D27.54(VSS) D27.59(VSS) D27.64(VSS) D27.70(VSS) D27.74(VSS) D27.78(VSS) D27.82(VSS) D27.91(VSS) D27.93(VSS) D27.97(VSS) D27.99(VSS) D27.104(VSS) D27.106(VSS) D27.107(VSS) D27.110(VSS) D27.112(VSS) D27.113(VSS) D27.116(VSS) D27.118(VSS) D27.119(VSS) D27.122(VSS) D27.124(VSS) D27.125(VSS) D27.128(VSS) R99.2 R100.1 R100.3 R100.4 R106.7 R106.8 R107.1 R113.1 R113.2 R113.3 R116.2 R123.1 R124.1 R128.2 X6.0(SHLD) X6.13(LED1)  [project net AGND_TX]
ACT_LED: D27.7(ACT_LED) R100.5 R125.1
CLK_TO_MAC: D7.L19(IO_L12P_T1_MRCC_14) D27.85(CLK_TO_MAC)
DIN: D7.H19(IO_L1N_T0_D01_DIN_14)
ETH_LED: X6.16(LED2)
FLASH_CE: D7.L16(IO_L6P_T0_FCS_B_14)
GMII_COL: D7.E21(IO_L7P_T1_D09_14) R103.1
GMII_CRS: D7.F20(IO_L4N_T0_D05_14) R103.2
GMII_GTX_CLK: D7.N18(IO_L13P_T2_MRCC_14) R102.2
GMII_RX_CLK: D7.J20(IO_L11P_T1_SRCC_14) R115.1
GMII_RX_DV: D7.G20(IO_L4P_T0_D04_14) R103.4
GMII_RX_ER: D7.F21(IO_L9N_T1_DQS_D13_14) R103.3
GMII_RXD0: D7.K22(IO_L16N_T2_A15_D31_14) R114.4
GMII_RXD1: D7.K21(IO_L16P_T2_CSI_B_14) R114.3
GMII_RXD2: D7.J22(IO_L10N_T1_D15_14) R114.2
GMII_RXD3: D7.J21(IO_L10P_T1_D14_14) R114.1
GMII_RXD4: D7.H22(IO_L8P_T1_D11_14) R110.4
GMII_RXD5: D7.G22(IO_L8N_T1_D12_14) R110.3
GMII_RXD6: D7.G21(IO_L9P_T1_DQS_14) R110.2
GMII_RXD7: D7.E22(IO_L7N_T1_D10_14) R110.1
GMII_TX_CLK: D7.M17(IO_L14P_T2_SRCC_14) R115.2
GMII_TX_EN: D7.N20(IO_L17P_T2_A14_D30_14) R115.4
GMII_TX_ER: D7.M20(IO_L18P_T2_A12_D28_14) R115.3
GMII_TXD0: D7.R22(IO_L24N_T3_A00_D16_14) R104.8
GMII_TXD1: D7.R21(IO_L24P_T3_A01_D17_14) R104.7
GMII_TXD2: D7.P21(IO_L22P_T3_A05_D21_14) R104.6
GMII_TXD3: D7.P22(IO_L22N_T3_A04_D20_14) R104.5
GMII_TXD4: D7.N22(IO_L15P_T2_DQS_RDWR_B_14) R112.4
GMII_TXD5: D7.M21(IO_L17N_T2_A13_D29_14) R112.3
GMII_TXD6: D7.M22(IO_L15N_T2_DQS_DOUT_CSO_B_14) R112.2
GMII_TXD7: D7.L21(IO_L18N_T2_A11_D27_14) R112.1
MDC: D7.P19(IO_L20P_T3_A08_D24_14) D27.81(MDC)
MDIA_N: D27.109(MDIA_N) R117.3 X6.10(TRD1-)
MDIA_P: D27.108(MDIA_P) R117.4 X6.11(TRD1+)
MDIB_N: D27.115(MDIB_N) R118.4 X6.4(TRD2+)
MDIB_P: D27.114(MDIB_P) R118.3 X6.5(TRD2-)
MDIC_N: D27.121(MDIC_N) R119.4 X6.2(TRD3-)
MDIC_P: D27.120(MDIC_P) R119.3 X6.3(TRD3+)
MDID_N: D27.127(MDID_N) R120.3 X6.8(TRD4+)
MDID_P: D27.126(MDID_P) R120.4 X6.9(TRD4-)
MDIO: D7.P20(IO_L20N_T3_A07_D23_14) D27.80(MDIO) R122.2
MOSI: D7.H18(IO_L1P_T0_D00_MOSI_14)
PHY_CLK: C288.1 D27.86(CLK_IN) Q2.3(OSC2)
PHY_INTn: D7.J19(IO_L3N_T0_DQS_EMCCLK_14) D27.3(INTERRUPT) R100.7
PHY_RESET: D7.F19(IO_L2N_T0_D03_14) D27.33(RESET)
XTAL: C289.1 D27.87(CLK_OUT) Q2.1(OSC1)
NetC290_1: C290.1 C291.1 D27.98(1V8_AVDD2) R126.2
NetC292_1: C292.1 C293.1 D27.100(1V8_AVDD3) R127.2
NetD27_1: D27.1(NON_IEEE) R100.8
NetD27_6: D27.6(TX_TCLK) R100.6
NetD27_8: D27.8(LNK10_LED) R107.8
NetD27_9: D27.9(LNK100_LED) R107.7
NetD27_10: D27.10(LNK1G_LED) R107.6
NetD27_13: D27.13(DUP_LED) R107.5
NetD27_14: D27.14(PHYADDR1) R113.8
NetD27_17: D27.17(PHYADDR2) R113.7
NetD27_18: D27.18(PHYADDR3) R113.6
NetD27_32: D27.32(TRST) R123.2
NetD27_34: D27.34(VDD_SEL) R105.1
NetD27_39: D27.39(COL) R101.1 R103.8
NetD27_40: D27.40(CRS) R99.1 R103.7
NetD27_41: D27.41(RX_ER) R103.6
NetD27_44: D27.44(RX_DV) R103.5
NetD27_45: D27.45(RXD7) R110.8
NetD27_46: D27.46(RXD6) R110.7
NetD27_47: D27.47(RXD5) R110.6
NetD27_50: D27.50(RXD4) R110.5
NetD27_51: D27.51(RXD3) R114.8
NetD27_52: D27.52(RXD2) R114.7
NetD27_55: D27.55(RXD1) R114.6
NetD27_56: D27.56(RXD0) R114.5
NetD27_57: D27.57(RX_CLK) R115.8
NetD27_60: D27.60(TX_CLK) R115.7 R116.1
NetD27_61: D27.61(TX_ER) R115.6
NetD27_62: D27.62(TX_EN) R115.5
NetD27_65: D27.65(TXD7) R112.8
NetD27_66: D27.66(TXD6) R112.7
NetD27_67: D27.67(TXD5) R112.6
NetD27_68: D27.68(TXD4) R112.5
NetD27_71: D27.71(TXD3) R104.4
NetD27_72: D27.72(TXD2) R104.3
NetD27_75: D27.75(TXD1) R104.2
NetD27_76: D27.76(TXD0) R104.1
NetD27_79: D27.79(GTX_CLK) R102.1
NetD27_88: D27.88(MAC_CLK_EN) R106.4
NetD27_89: D27.89(MDIX_EN) R106.3
NetD27_94: D27.94(MULTI_EN) R106.2
NetD27_95: D27.95(PHYADDR4) R106.1
NetD27_102: D27.102(BG_REF) R128.1
NetR124_2: R124.2 X6.15
NetR125_2: R125.2 X6.14

Not connected (* = marked no-connect by the designer): D7 G18(IO_L2P_T0_D02_14) H20(IO_L11N_T1_SRCC_14)* K16(IO_0_14) K17(IO_L6N_T0_D08_VREF_14) K19(IO_L5N_T0_D07_14) L18(IO_L5P_T0_D06_14) L20(IO_L12N_T1_MRCC_14)* M16(IO_25_14) M18(IO_L14N_T2_SRCC_14)* N17(IO_L23N_T3_A02_D18_14) N19(IO_L13N_T2_MRCC_14)* P16(IO_L23P_T3_A03_D19_14) P17(IO_L21N_T3_DQS_A06_D22_14) R17(IO_L21P_T3_DQS_14) R18(IO_L19P_T3_A10_D26_14) R19(IO_L19N_T3_A09_D25_VREF_14); D27 2(RESERVED) 23(RESERVED) 24(TCK) 27(TMS) 28(TDO) 31(TDI) 84(RESERVED); R113 4 5

### Layout directives
net class Power: 1.8V, 1V8_ETH, 1V8_ETH_A, 2.5V, 2V5_ETH, 2V5_ETH_A, DVDD_ETH, GND
differential pair: MDIA_N, MDIA_P, MDIB_N, MDIB_P, MDIC_N, MDIC_P, MDID_N, MDID_P

### Notes on the sheet
- Add caps at 2.5V near PHY
- Подп. и дата
- Инв. № дубл.
- Взам. инв. №
- Инв. № подл.
- Лист
- Изм.
- № докум.
- Подп.
- Дата
- Копировал
- Формат А3
- (in symbol 0826-1X1T-23-F, part A) PORT
- (in symbol 0826-1X1T-23-F, part B) LED; ORANGE; GREEN; YELLOW
- (in symbol DP83865, part A) MDI
- (in symbol DP83865, part B) MAC
- (in symbol DP83865, part C) CFGLED
- (in symbol DP83865, part D) CLK
- (in symbol DP83865, part E) MGT
- (in symbol DP83865, part F) JTAG
- (in symbol DP83865, part G) PWR
- (in symbol XC7K160T-2FBG484C, part B) BANK 14

### Library data of the parts
C282-C287 = CAP: as C186 on sheet Codec's
C288 C289 = CAP: SMD Capacitor; Manufacturer: Murata; Material: NP0; Tolerance: 1%; Voltage: 25V; Type: Ceramic Capacitor; P/N: GRM1555C1E220JA01D
C290 C292 C299-C311 C317-C330 = CAP: as C198 on sheet Codec's
C291 C293 = CAP uF: SMD Capacitor; Manufacturer: Murata; Material: X5R; Tolerance: 20%; Voltage: 6.3V; Type: Ceramic Capacitor; P/N: GRM32ER60J107ME20L
C294 C296 C312 C314 = CAP: as C200 on sheet Codec's
C295 C297 C313 C315 = CAP: as C201 on sheet Codec's
C298 C316 = CAP uF: as C204 on sheet Codec's
D7 = XC7K160T-2FBG484C: Xilinx 7-Series FPGA; Speed Grade: -2; Manufacturer: Xilinx; Name: XC7K160T-2FBG484C; Series: 7-Series FPGA; Package: 484 Ball FBG
D27 = DP83865: 10/100/1000 Ethernet Physical Layer; Name: DP83865DVH; Package: LQFP-128; Type: 0/100/1000 Ethernet Physical Layer
L38-L41 = Inductor LF: as L32-L36 on sheet DaughterBoard; Temperature Range: -25ºC to 85ºC; Series: LQH; P/N: LQH32PN1R0NNC
Q2 = Quartz: Qurtz; Manufacturer: GEYER ELECTRONIC; Name: KX-13T; Tolerance: ± 30 ppm; Frequancy: 25.000MHz
R99 R101 R116 = RES: SMD Resistor; Name: Chip SMD Resistor; Power: 0.062 Wt; Tolerance: 5%; P/N: ERJ-2GEJ102X; Temperature Range: -55…155°C
R100 R106 R107 R113 = RES 4x0402: Chip Resistor Array; Manufacturer: Panasonic; Name: EXBN8V; Number of Resistors: 4; Tolerance: 5%; P/N: EXB-N8V202JX; Type: 0402 Array Concave Terminal; Number of Terminals: 8; Series: EXB
R102 = RES: SMD Resistor; Name: Chip SMD Resistor; Power: 0.062 Wt; Tolerance: 5%; P/N: ERJ-2GEJ330X; Temperature Range: -55…155°C
R103 R104 R110 R112 R114 R115 = RES 4x0402: Chip Resistor Array; Manufacturer: Panasonic; Name: EXBN8V; Number of Resistors: 4; Tolerance: 5%; P/N: EXB-N8V330JX; Type: 0402 Array Concave Terminal; Number of Terminals: 8; Series: EXB
R105 R122 R123 = RES: SMD Resistor; Name: Chip SMD Resistor; Power: 0.062 Wt; Tolerance: 5%; P/N: ERJ-2GEJ202X; Temperature Range: -55…155°C
R117-R120 = RES 2x0402: Chip Resistor Array; Manufacturer: Panasonic; Name: EXB24V; Number of Resistors: 2; Tolerance: 5%; P/N: EXB-24V510JX; Type: 0402 Array Convex Terminal; Number of Terminals: 4; Series: EXB
R124 R125 = RES: SMD Resistor; Name: Chip SMD Resistor; Power: 0.062 Wt; Tolerance: 5%; P/N: ERJ-2GEJ680X; Temperature Range: -55…155°C
R126 R127 = RES: SMD Resistor; Manufacturer: Panasonic Electronic Components; Name: Chip SMD Resistor; Power: 0.062 Wt; Tolerance: 5%; P/N: ERJ-2GEJ330X; Temperature Range: -55…155°C
R128 = RES: SMD Resistor; Manufacturer: Panasonic Electronic Components; Name: Chip SMD Resistor; Power: 0.062 Wt; Tolerance: 5%; P/N: ERJ-2RKF9761X; Temperature Range: -55…155°C
X6 = 0826-1X1T-23-F: Gigabit Ethernet Single Port with LEDs; Name: 0826-1X1T-23-F; Type: Gigabit Ethernet Single Port with LEDs